# Altium project HYDRA_V3_RECOVERY.PrjPcb (part 1 of 2)
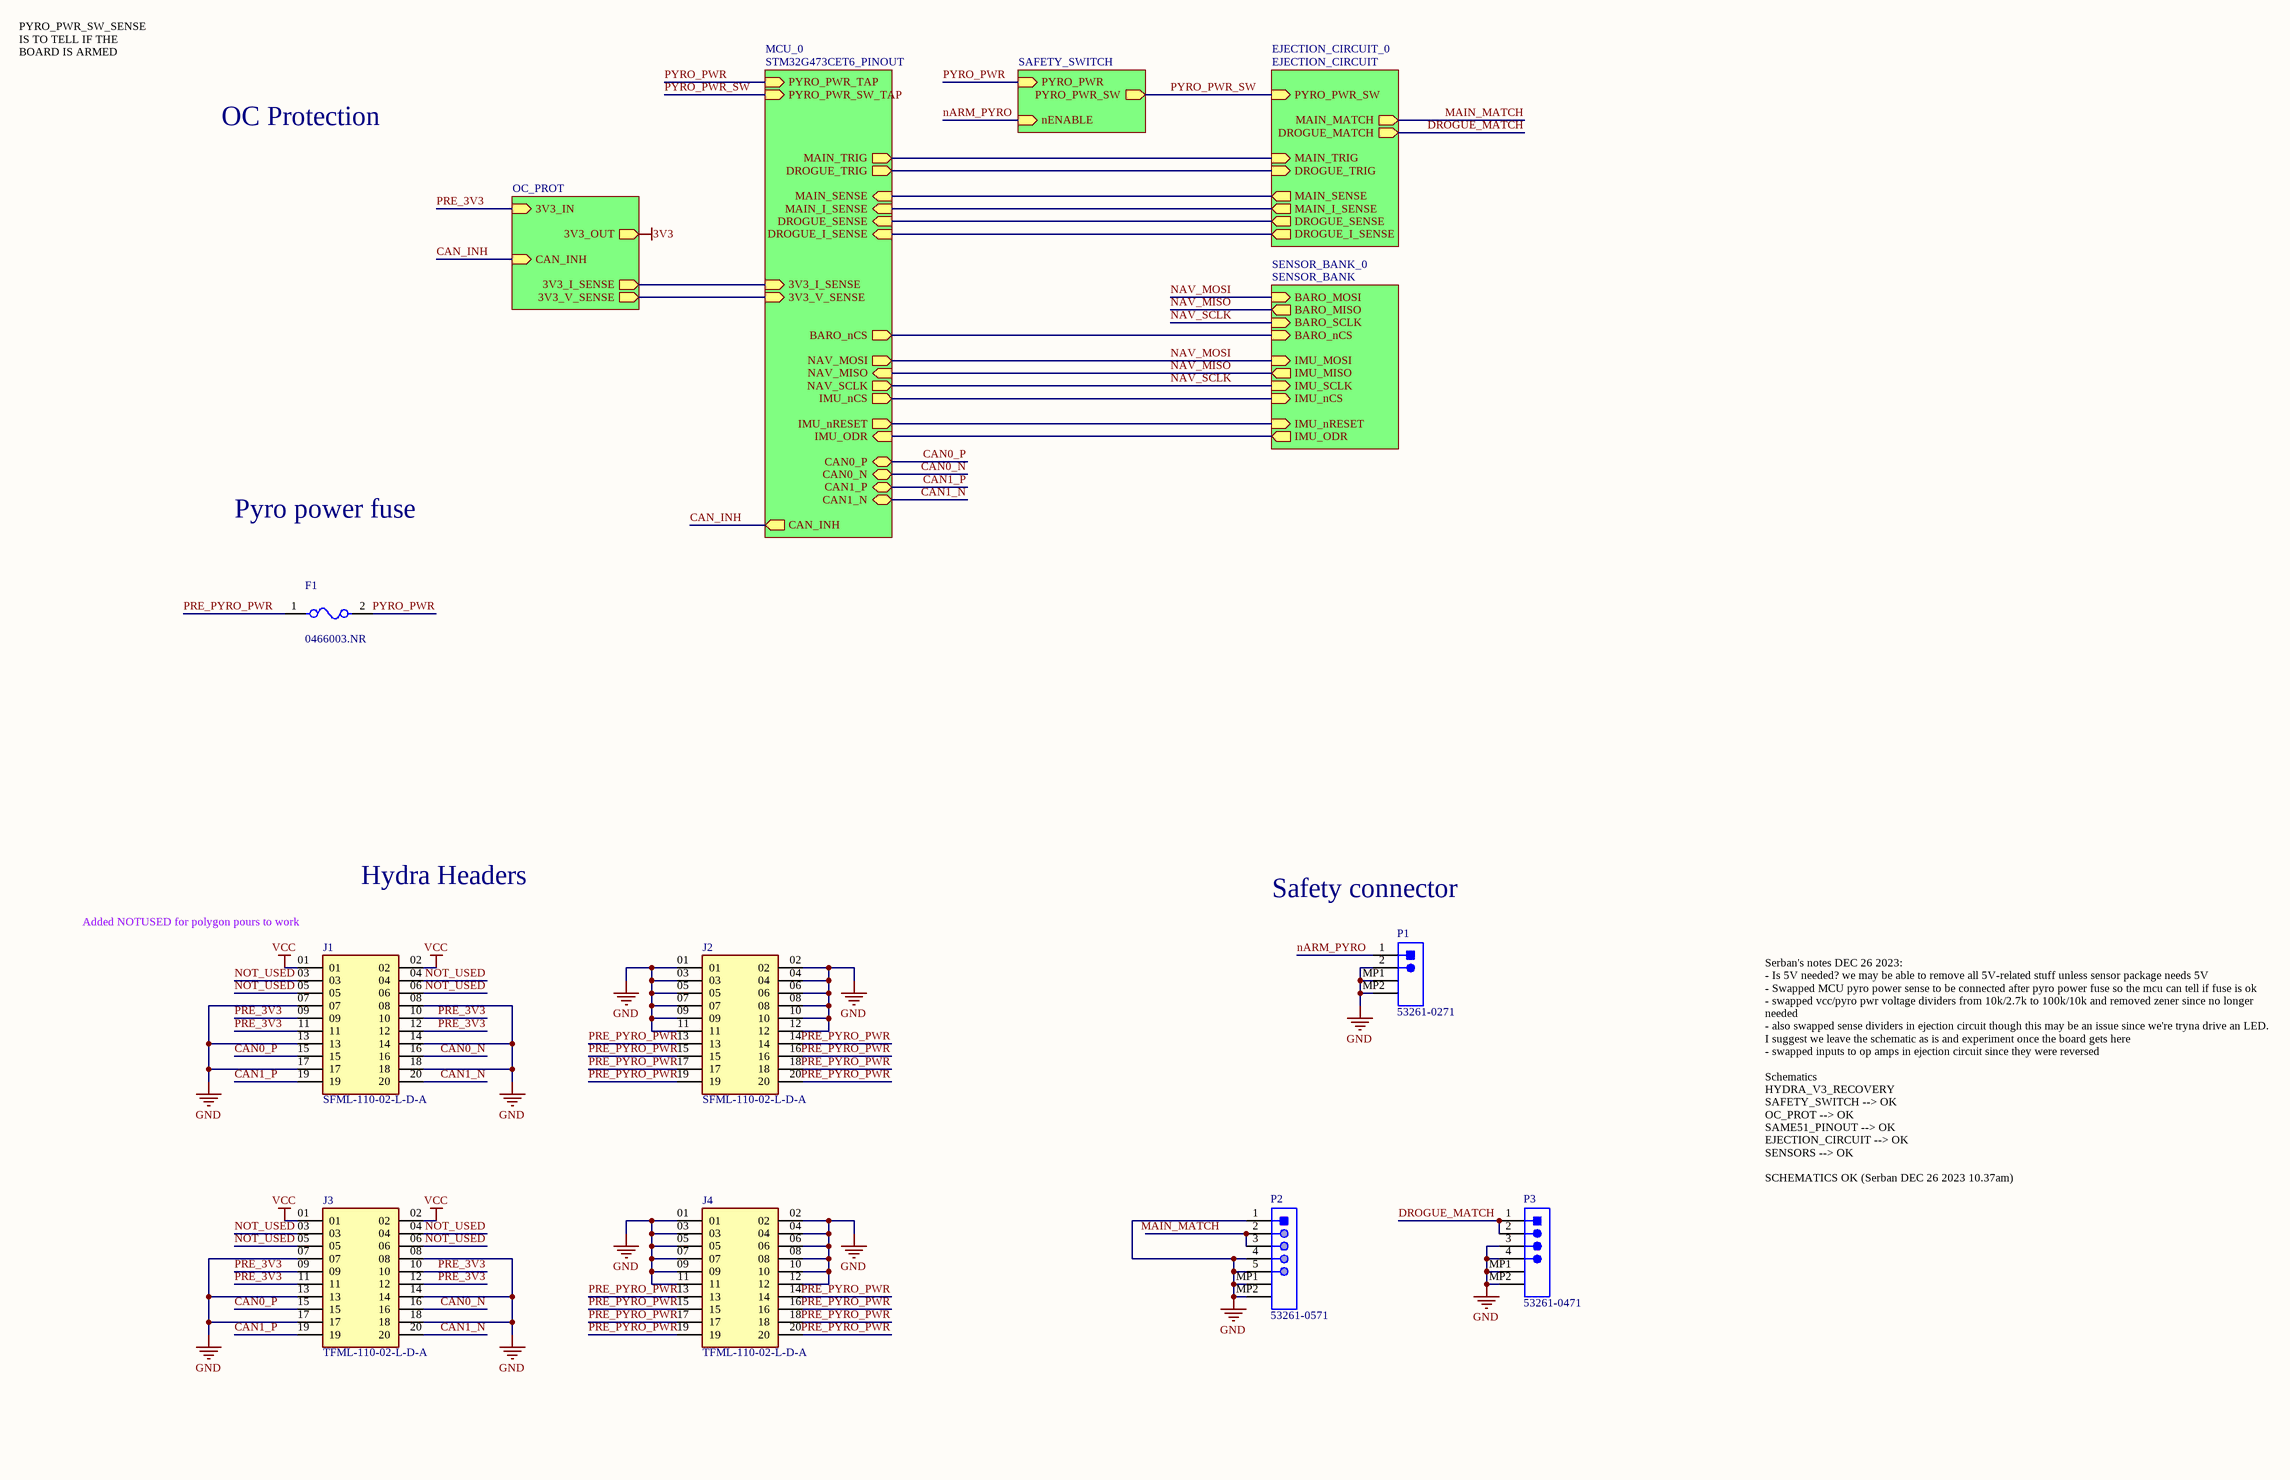
[diagram p0: HYDRA_V3_RECOVERY.SchDoc]
6 sheets, 129 parts. Net scope: hierarchical (ports join the sheet entries above them; power ports are global).
Board files: HYDRA_V3_RECOVERY.PcbDoc, HYDRA_V3_RECOVERY_V2.PcbDoc
Sheets:
  HYDRA_V3_RECOVERY.SchDoc
    OC_PROT = OC_PROT.SchDoc
    MCU_0 = STM32G473CET6_PINOUT.SchDoc
    EJECTION_CIRCUIT_0 = EJECTION_CIRCUIT.SchDoc
    SENSOR_BANK_0 = SENSOR_BANK.SchDoc
    SAFETY_SWITCH_0 = SAFETY_SWITCH.SchDoc

## Sheet HYDRA_V3_RECOVERY.SchDoc
size C; SheetNumber: 1; SheetTotal: 6

### Parts
F1  0466003.NR  [FP-0466-MFG]
J1  SFML-110-02-L-D-A  [SFML-110-02-L-D-A-Footprint-1]
J2  SFML-110-02-L-D-A  [SFML-110-02-L-D-A-Footprint-1]
J3  TFML-110-02-L-D-A  [TFML-110-02-L-D-A-Footprint-1]
J4  TFML-110-02-L-D-A  [TFML-110-02-L-D-A-Footprint-1]
P1  53261-0271  [MOLX-53261-0271_V]
P2  53261-0571  [MOLX-52361-0571-5_V]
P3  53261-0471  [MOLEX-53261-0471_V]

### Sub-sheets
EJECTION_CIRCUIT_0 = EJECTION_CIRCUIT: MAIN_TRIG (in), DROGUE_TRIG (in), PYRO_PWR_SW (in), MAIN_SENSE (out), DROGUE_SENSE (out), MAIN_I_SENSE (out), DROGUE_I_SENSE (out), MAIN_MATCH (out), DROGUE_MATCH (out)
MCU_0 = STM32G473CET6_PINOUT: MAIN_TRIG (out), DROGUE_TRIG (out), MAIN_SENSE (in), MAIN_I_SENSE (in), DROGUE_SENSE (in), DROGUE_I_SENSE (in), BARO_nCS (out), IMU_nCS (out), IMU_nRESET (out), IMU_ODR (in), CAN0_P (bidir), CAN0_N (bidir), CAN1_P (bidir), CAN1_N (bidir), CAN_INH (out), NAV_MOSI (out), NAV_MISO (in), NAV_SCLK (out), 3V3_I_SENSE (in), 3V3_V_SENSE (in), PYRO_PWR_TAP (in), PYRO_PWR_SW_TAP (in)
OC_PROT = OC_PROT: 3V3_IN (in), 3V3_OUT (out), CAN_INH (in), 3V3_I_SENSE (out), 3V3_V_SENSE (out)
SAFETY_SWITCH_0 = SAFETY_SWITCH: PYRO_PWR (in), PYRO_PWR_SW (out), nENABLE (in)
SENSOR_BANK_0 = SENSOR_BANK: IMU_MOSI (in), IMU_MISO (out), IMU_ODR (out), IMU_nCS (in), IMU_SCLK (in), IMU_nRESET (in), BARO_SCLK (in), BARO_MOSI (in), BARO_MISO (out), BARO_nCS (in)

### Nets
GND: J1.07 J1.08 J1.13 J1.14 J1.17 J1.18 J2.01 J2.02 J2.03 J2.04 J2.05 J2.06 J2.07 J2.08 J2.09 J2.10 J2.11 J2.12 J3.07 J3.08 J3.13 J3.14 J3.17 J3.18 J4.01 J4.02 J4.03 J4.04 J4.05 J4.06 J4.07 J4.08 J4.09 J4.10 J4.11 J4.12 P1.2 P1.MP1 P1.MP2 P2.1 P2.4 P2.5 P2.MP1 P2.MP2 P3.3 P3.4 P3.MP1 P3.MP2
VCC: J1.01 J1.02 J3.01 J3.02
3V3_I_SENSE: sheet OC_PROT/3V3_I_SENSE, sheet MCU_0/3V3_I_SENSE
BARO_nCS: sheet MCU_0/BARO_nCS, sheet SENSOR_BANK_0/BARO_nCS
CAN0_N: J1.16 J3.16 ; sheet MCU_0/CAN0_N
CAN0_P: J1.15 J3.15 ; sheet MCU_0/CAN0_P
CAN1_N: J1.20 J3.20 ; sheet MCU_0/CAN1_N
CAN1_P: J1.19 J3.19 ; sheet MCU_0/CAN1_P
CAN_INH: sheet OC_PROT/CAN_INH, sheet MCU_0/CAN_INH
DROGUE_I_SENSE: sheet MCU_0/DROGUE_I_SENSE, sheet EJECTION_CIRCUIT_0/DROGUE_I_SENSE
DROGUE_MATCH: P3.1 P3.2 ; sheet EJECTION_CIRCUIT_0/DROGUE_MATCH
DROGUE_SENSE: sheet MCU_0/DROGUE_SENSE, sheet EJECTION_CIRCUIT_0/DROGUE_SENSE
DROGUE_TRIG: sheet MCU_0/DROGUE_TRIG, sheet EJECTION_CIRCUIT_0/DROGUE_TRIG
IMU_nCS: sheet MCU_0/IMU_nCS, sheet SENSOR_BANK_0/IMU_nCS
IMU_nRESET: sheet MCU_0/IMU_nRESET, sheet SENSOR_BANK_0/IMU_nRESET
IMU_ODR: sheet MCU_0/IMU_ODR, sheet SENSOR_BANK_0/IMU_ODR
MAIN_I_SENSE: sheet MCU_0/MAIN_I_SENSE, sheet EJECTION_CIRCUIT_0/MAIN_I_SENSE
MAIN_MATCH: P2.2 P2.3 ; sheet EJECTION_CIRCUIT_0/MAIN_MATCH
MAIN_SENSE: sheet MCU_0/MAIN_SENSE, sheet EJECTION_CIRCUIT_0/MAIN_SENSE
MAIN_TRIG: sheet MCU_0/MAIN_TRIG, sheet EJECTION_CIRCUIT_0/MAIN_TRIG
nARM_PYRO: P1.1 ; sheet SAFETY_SWITCH_0/nENABLE
NAV_MISO: sheet MCU_0/NAV_MISO, sheet SENSOR_BANK_0/IMU_MISO, sheet SENSOR_BANK_0/BARO_MISO  [project net BARO_MISO]
NAV_MOSI: sheet MCU_0/NAV_MOSI, sheet SENSOR_BANK_0/IMU_MOSI, sheet SENSOR_BANK_0/BARO_MOSI  [project net BARO_MOSI]
NAV_SCLK: sheet MCU_0/NAV_SCLK, sheet SENSOR_BANK_0/IMU_SCLK, sheet SENSOR_BANK_0/BARO_SCLK  [project net BARO_SCLK]
NOT_USED: J1.03 J1.04 J1.05 J1.06 J3.03 J3.04 J3.05 J3.06
PRE_3V3: J1.09 J1.10 J1.11 J1.12 J3.09 J3.10 J3.11 J3.12 ; sheet OC_PROT/3V3_IN  [project net 3V3_PRE_SHUNT]
PRE_PYRO_PWR: F1.1 J2.13 J2.14 J2.15 J2.16 J2.17 J2.18 J2.19 J2.20 J4.13 J4.14 J4.15 J4.16 J4.17 J4.18 J4.19 J4.20
PYRO_PWR: F1.2 ; sheet MCU_0/PYRO_PWR_TAP, sheet SAFETY_SWITCH_0/PYRO_PWR
PYRO_PWR_SW: sheet MCU_0/PYRO_PWR_SW_TAP, sheet EJECTION_CIRCUIT_0/PYRO_PWR_SW, sheet SAFETY_SWITCH_0/PYRO_PWR_SW
NetR51_2: sheet OC_PROT/3V3_V_SENSE, sheet MCU_0/3V3_V_SENSE

### Notes on the sheet
- PYRO_PWR_SW_SENSE IS TO TELL IF THE BOARD IS ARMED
- OC Protection
- Pyro power fuse
- Hydra Headers
- Safety connector
- (near J1) Added NOTUSED for polygon pours to work
- Serban's notes DEC 26 2023:
  - Is 5V needed? we may be able to remove all 5V-related stuff unless sensor package needs 5V
  - Swapped MCU pyro power sense to be connected after pyro power fuse so the mcu can tell if fuse is ok
  - swapped vcc/pyro pwr voltage dividers from 10k/2.7k to 100k/10k and removed zener since no longer needed
  - also swapped sense dividers in ejection circuit though this may be an issue since we're tryna drive an LED. I suggest we leave the schematic as is and experiment once the board gets here
  - swapped inputs to op amps in ejection circuit since they were reversed
  Schematics
  HYDRA_V3_RECOVERY
  SAFETY_SWITCH --> OK
  OC_PROT --> OK
  SAME51_PINOUT --> OK
  EJECTION_CIRCUIT --> OK
  SENSORS --> OK
  SCHEMATICS OK (Serban DEC 26 2023 10.37am)

### Library data of the parts
F1 = CMP-08605-000054-1: FUSE BOARD MNT 3A 32VAC/VDC 1206; Manufacturer: Littelfuse; Fuse Interrupt Ac Current: 50A; Fuse Voltage Drop: 75.99mV; Max Fuse Ac Voltage: 32V; Fuse I2T: 0.576A2Sec; Resistance: 0.019Ω; Fuse Blow Speed: Fast; Value: 0.019Ω; ComponentLink2Description: Datasheet; Fuse Current: 3A; RoHS: TRUE; Mouser Description: Surface Mount Fuses 32V 3A VFA Slimline; Height: 0.66mm; Octopart: https://octopart.com/0466003.nr-littelfuse-565175; Package: 0466; Fuse Interrupt Dc Current: 50A; Manufacturer Part Number: 0466003.NR; Temperature Range Low: -55°C; ComponentLink2URL: https://www.littelfuse.com/~/media/electronics/datasheets/fuses/littelfuse_fuse_466_datasheet.pdf.pdf; Digikey Description: FUSE BOARD MNT 3A 32VAC/VDC 1206; Voltage Rating: 32V; Category: Fuse; Lead Free: Yes; Device Class L2: Fuses; Automotive: No; Max Fuse Dc Voltage: 32V; Temperature Range High: +90°C; Device Class L3: unset; Device Class L1: Circuit Protection; Temperature: -55°C to +90°C
J1 J2 = CMP-002-00043-1: Board Connector, 20 Contact(s), 2 Row(s), Female, Straight, 0.05 inch Pitch, Surface Mount Terminal, Locking, Black Insulator, Socket; RoHS Compliant: Yes; Connector Type: BOARD CONNECTOR; Mounting Technology: Board
J3 J4 = CMP-002-00042-1: Board Connector, 20 Contact(s), 2 Row(s), Male, Straight, Surface Mount Terminal; Connector Type: BOARD CONNECTOR; Mounting Technology: Board; RoHS Compliant: Yes
P1 = CMP-2000-05633-1: PicoBlade(TM) Header, Right Angle, -40 to 85 degC, 2-Pin SMD, RoHS, Tape and Reel; Current - Max: 1A; Brand: Molex; Voltage Rating: 125V; Number of Positions: 2; Pitch: 1.25mm; Package Version: Rev. H, 11/2014; Factory Pack Quantity: 1000; Datasheet URL: http://www.molex.com/webdocs/datasheets/pdf/en-us/0532610271_PCB_HEADERS.pdf; Datasheet Version: 03/2016; Housing Material: Thermoplastic; RoHS: Details; Product Type: Headers; Number of Rows: 1; Termination Style: SMD; Mounting Technology: SurfaceMount; Number of Positions / Contacts: 2; Package URL: http://www.molex.com/pdm_docs/sd/532610271_sd.pdf; Mounting Angle: Right; Mounting Style: SMD/SMT; Manufacturer: Molex; Product Category: 1.25mmConnectors; Tradename: PicoBlade; Voltage - Max: 125V; Manufacturer URL: http://www.molex.com/; Series: 53261; Package Description: 2-Leads Header, Pitch 1.25 mm, Mated Height 3.4 mm; Package Reference: 53261-0271; Current Rating: 1A; Contact Plating: Tin; Contact Material: PhosphorBronze; Type: Shrouded; Packaging: Reel
P2 = CMP-2000-05249-1: Male Header, Pitch 1.25 mm, 1 x 5 Position, Height 3.4 mm, RoHS, Tape and Reel; Brand: Molex; Mounting Angle: Right; Number of Positions: 5; Voltage Rating: 125V; Current Rating: 1A; Pitch: 1.25mm; Datasheet Version: Rev. D, 04/2004; Housing Material: Thermoplastic; Series: 53261; RoHS: Details; Product Category: Headers&WireHousings; Datasheet URL: http://datasheet.octopart.com/532610571-Molex-datasheet-8343080.pdf; Manufacturer URL: http://www.molex.com/; Contact Material: PhosphorBronze; Tradename: PicoBlade; Number of Rows: 1; Product Type: Headers; Manufacturer: Molex; Type: Shrouded; Termination Style: SMD; Mounting Style: SMD/SMT; Factory Pack Quantity: 1000; Contact Plating: Tin; Packaging: Reel; Number of Positions / Contacts: 5
P3 = CMP-2000-05238-1: Male Header, Pitch 1.25 mm, 1 x 4 Position, Height 3.4 mm, -40 to 85 degC, RoHS, Tape and Reel; Current Rating: 1A; Brand: Molex; Number of Positions / Contacts: 4; Pitch: 1.25mm; Voltage Rating: 125V; Mounting Angle: Right; Manufacturer URL: http://www.molex.com/; Factory Pack Quantity: 1000; Housing Material: Thermoplastic; Datasheet URL: http://www.molex.com/pdm_docs/sd/532610471_sd.pdf; Tradename: PicoBlade; Product Type: Headers; Contact Plating: Tin; Contact Material: PhosphorBronze; Package Description: 1.25mm Pitch PicoBlade(TM) Header, Surface Mount, Right Angle, Lead-Free, 4 Circuits; Mounting Style: SMD/SMT; Manufacturer: Molex; Series: 53261; Packaging: Reel; Number of Rows: 1; RoHS: Details; Number of Positions: 4; Product Category: Headers&WireHousings; Datasheet Version: Rev. G, 01/2012; Type: Shrouded; Termination Style: SMD

## Sheet OC_PROT.SchDoc
size C; SheetNumber: 2; SheetTotal: 6
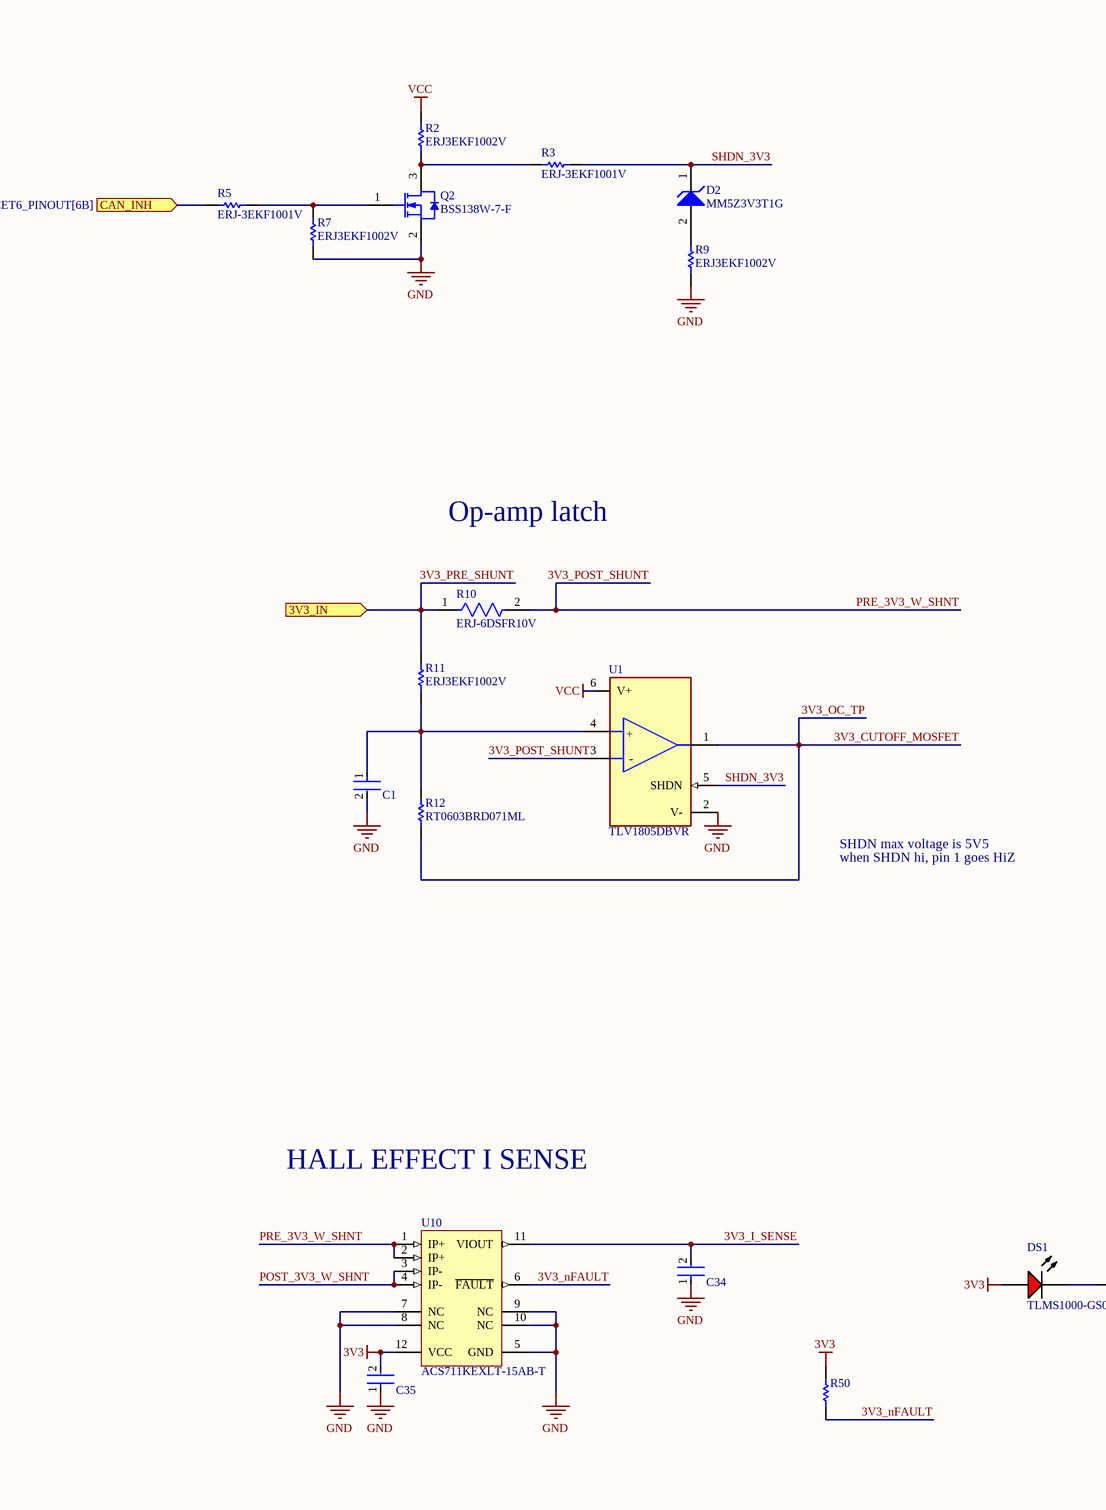
[diagram p1: OC_PROT.SchDoc, left]
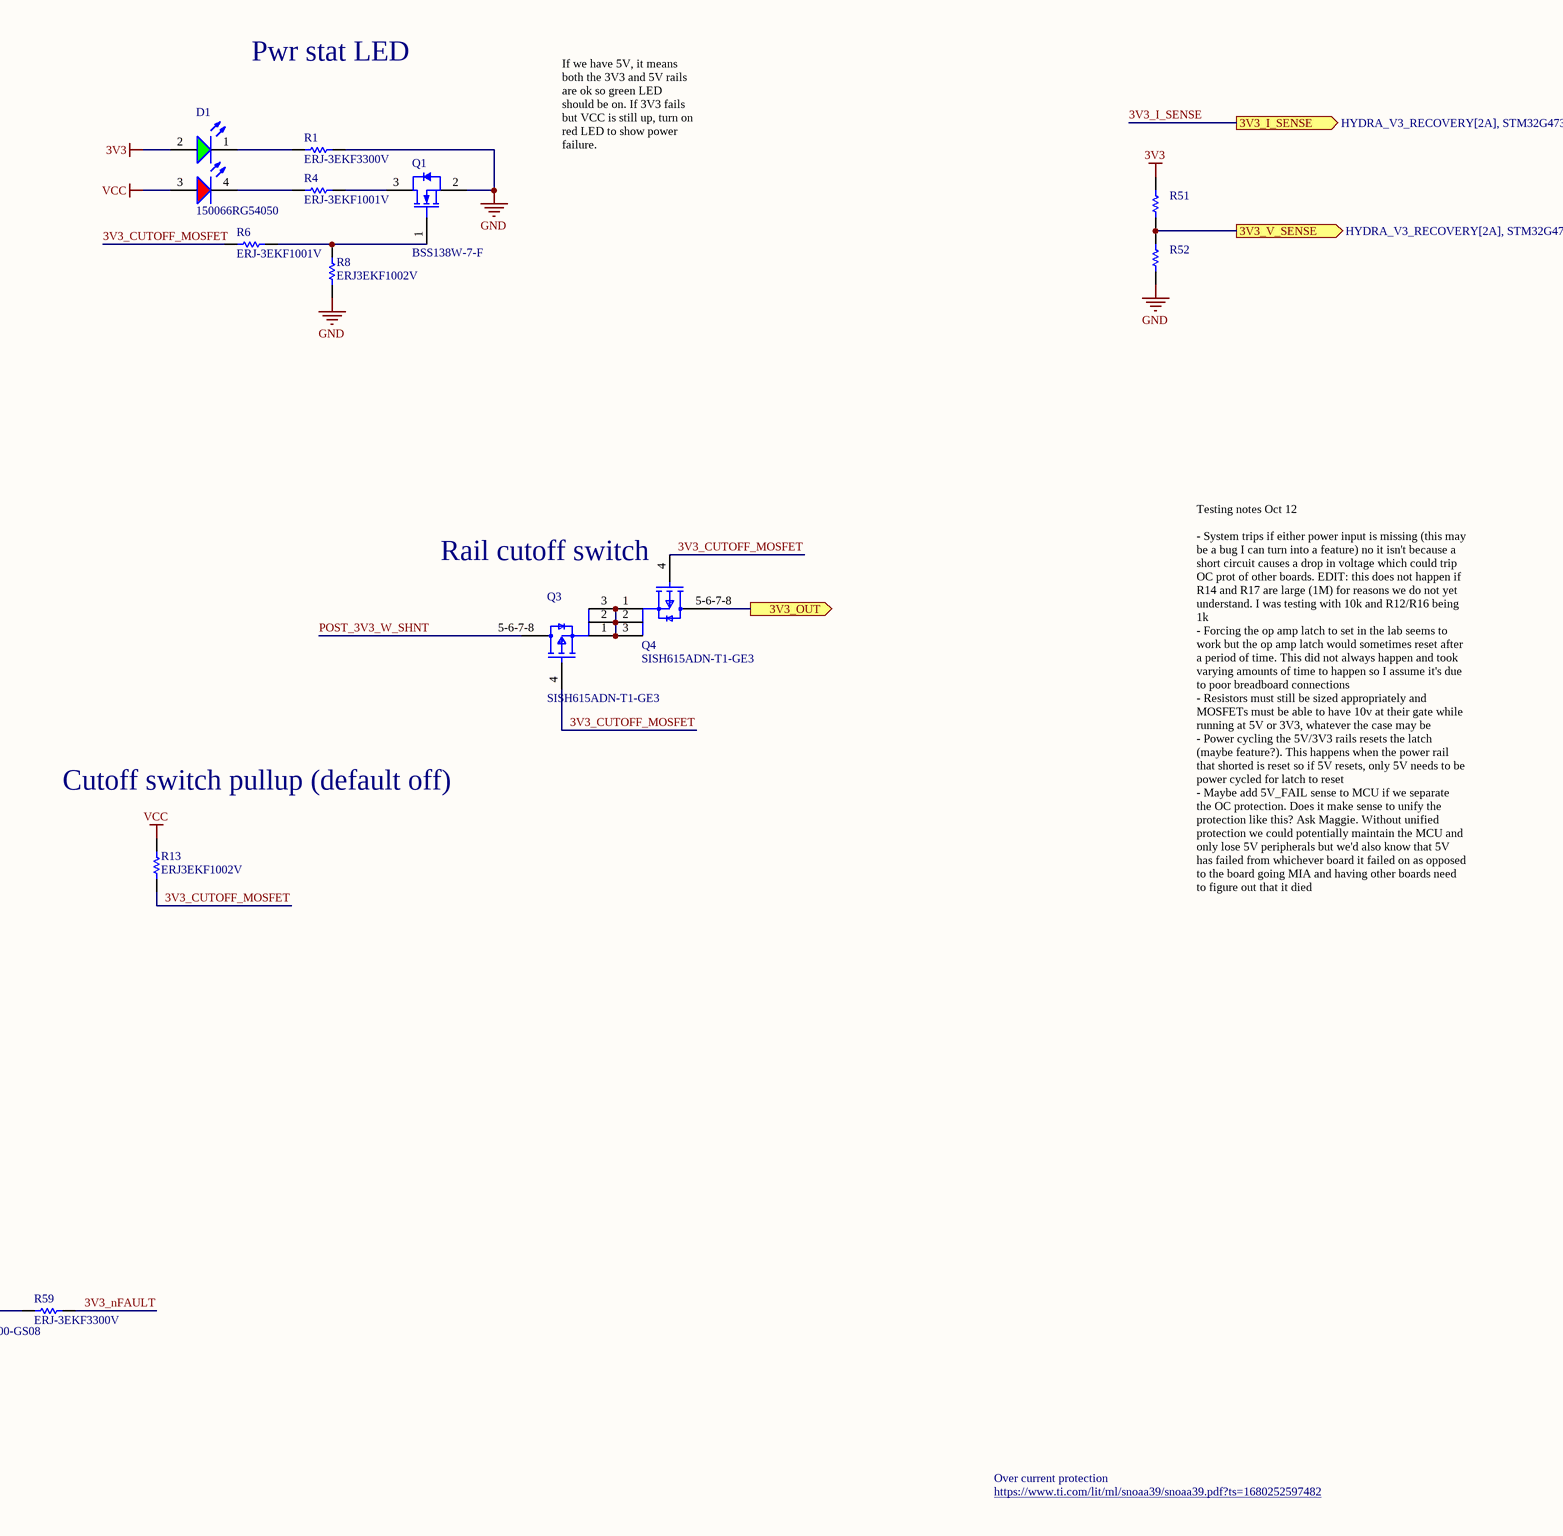
[diagram p2: OC_PROT.SchDoc, right]

### Parts
C1  C0402C104K8PACTU  [FP-C0402-BB-MFG]  (value not drawn)
C34  C0402C104K8PACTU  [FP-C0402-BB-MFG]  (value not drawn)
C35  C0402C104K8PACTU  [FP-C0402-BB-MFG]  (value not drawn)
D1  150066RG54050  [WL-SBCD_0606]
D2  MM5Z3V3T1G  [ONSC-SOD-523-2-502-01_V]
DS1  TLMS1000-GS08  [VISH-TLMS1000_V]
Q1  BSS138W-7-F  [DIOD-SOT323-3_V]
Q2  BSS138W-7-F  [DIOD-SOT323-3_V]
Q3  SISH615ADN-T1-GE3  [SISH615ADN-T1-GE3-Footprint-1]
Q4  SISH615ADN-T1-GE3  [SISH615ADN-T1-GE3-Footprint-1]
R1  ERJ-3EKF3300V  [RESC1608X55X30LL15T15]
R2  ERJ3EKF1002V  [RESC1609X55X30LL15T15]
R3  ERJ-3EKF1001V  [RESC1608X55X30LL15T15]
R4  ERJ-3EKF1001V  [RESC1608X55X30LL15T15]
R5  ERJ-3EKF1001V  [RESC1608X55X30LL15T15]
R6  ERJ-3EKF1001V  [RESC1608X55X30LL15T15]
R7  ERJ3EKF1002V  [RESC1609X55X30LL15T15]
R8  ERJ3EKF1002V  [RESC1609X55X30LL15T15]
R9  ERJ3EKF1002V  [RESC1609X55X30LL15T15]
R10  ERJ-6DSFR10V  [FP-ERJ6D-MFG]
R11  ERJ3EKF1002V  [RESC1609X55X30LL15T15]
R12  RT0603BRD071ML  [RESC1608X55X30NL20T20]
R13  ERJ3EKF1002V  [RESC1609X55X30LL15T15]
R50  ERJ3EKF1002V  [RESC1609X55X30LL15T15]  (value not drawn)
R51  ERJ3EKF1002V  [RESC1609X55X30LL15T15]  (value not drawn)
R52  ERJ3EKF1002V  [RESC1609X55X30LL15T15]  (value not drawn)
R59  ERJ-3EKF3300V  [RESC1608X55X30LL15T15]
U1  TLV1805DBVR  [FP-DBV0006A-IPC_C]
U10  ACS711KEXLT-15AB-T  [ALEG-EX-12_V]

### Ports
3V3_I_SENSE (out, see HYDRA_V3_RECOVERY[2A], STM32G473CET6_PINOUT[4A]), 3V3_IN (in, see HYDRA_V3_RECOVERY[2A]), 3V3_OUT (out, see HYDRA_V3_RECOVERY[2A]), 3V3_V_SENSE (out, see HYDRA_V3_RECOVERY[2A], STM32G473CET6_PINOUT[4A]), CAN_INH (in, see HYDRA_V3_RECOVERY[2A], STM32G473CET6_PINOUT[6B])

### Nets
3V3: C35.2 D1.2(A) DS1.1(A) Q4.5-6-7-8(D) R50.2 R51.1 U10.12(VCC) ; port 3V3_OUT
GND: C1.2 C34.1 C35.1 Q1.2(S) Q2.2(S) R1.2 R7.1 R8.1 R9.1 R52.2 U1.2(V-) U10.5(GND) U10.7(NC) U10.8(NC) U10.9(NC) U10.10(NC)
VCC: D1.3(A) R2.2 R13.1 U1.6(V+)
3V3_CUTOFF_MOSFET: Q3.4(G) Q4.4(G) R6.2 R12.1 R13.2 U1.1(OUT)  [also labelled 3V3_OC_TP]
3V3_I_SENSE: C34.2 U10.11(VIOUT) ; port 3V3_I_SENSE
3V3_nFAULT: R50.1 R59.2 U10.6(~{FAULT})
3V3_POST_SHUNT: R10.2 U1.3(-IN) U10.1(IP+) U10.2(IP+)  [also labelled PRE_3V3_W_SHNT]
3V3_PRE_SHUNT: R10.1 R11.2 ; port 3V3_IN
CAN_INH: R5.2 ; port CAN_INH
POST_3V3_W_SHNT: Q3.5-6-7-8(D) U10.3(IP-) U10.4(IP-)
SHDN_3V3: D2.1(K) R3.2 U1.5(SHDN)
NetC1_1: C1.1 R11.1 R12.2 U1.4(+IN)
NetD1_1: D1.1(K) R1.1
NetD1_4: D1.4(K) R4.2
NetD2_2: D2.2(A) R9.2
NetDS1_2: DS1.2(K) R59.1
NetQ1_1: Q1.1(G) R6.1 R8.2
NetQ1_3: Q1.3(D) R4.1
NetQ2_1: Q2.1(G) R5.1 R7.2
NetQ2_3: Q2.3(D) R2.1 R3.1
NetQ3_1: Q3.1(S) Q3.2(S) Q3.3(S) Q4.1(S) Q4.2(S) Q4.3(S)
NetR51_2: R51.2 R52.1 ; port 3V3_V_SENSE

### Notes on the sheet
- Pwr stat LED
- If we have 5V, it means both the 3V3 and 5V rails are ok so green LED should be on. If 3V3 fails but VCC is still up, turn on red LED to show power failure.
- Op-amp latch
- (near Q4) Rail cutoff switch
- Cutoff switch pullup (default off)
- SHDN max voltage is 5V5
- when SHDN hi, pin 1 goes HiZ
- Testing notes Oct 12
  - System trips if either power input is missing (this may be a bug I can turn into a feature) no it isn't because a short circuit causes a drop in voltage which could trip OC prot of other boards. EDIT: this does not happen if R14 and R17 are large (1M) for reasons we do not yet understand. I was testing with 10k and R12/R16 being 1k
  - Forcing the op amp latch to set in the lab seems to work but the op amp latch would sometimes reset after a period of time. This did not always happen and took varying amounts of time to happen so I assume it's due to poor breadboard connections
  - Resistors must still be sized appropriately and MOSFETs must be able to have 10v at their gate while running at 5V or 3V3, whatever the case may be
  - Power cycling the 5V/3V3 rails resets the latch (maybe feature?). This happens when the power rail that shorted is reset so if 5V resets, only 5V needs to be power cycled for latch to reset
  - Maybe add 5V_FAIL sense to MCU if we separate the OC protection. Does it make sense to unify the protection like this? Ask Maggie. Without unified protection we could potentially maintain the MCU and only lose 5V peripherals but we'd also know that 5V has failed from whichever board it failed on as opposed to the board going MIA and having other boards need to figure out that it died
- HALL EFFECT I SENSE
- https://www.ti.com/lit/ml/snoaa39/snoaa39.pdf?ts=1680252597482
- Over current protection
- (in symbol CMP-04896-000098-1) +; -

### Library data of the parts
C1 C34 C35 = CMP-2008-02046-2: CAP CER 0.1UF 10V X5R 0402; Manufacturer: Kemet; Material: Ceramic; Capacitance: 0.10 μF; Temperature Coefficient: 15%; Tolerance: 0.1; Value: 0.10 μF; Package: C0402-BB; Temperature: -55°C to +125°C; ComponentLink2Description: Datasheet; Temperature Characteristic: X5R; Device Class L1: Passive Components; Height: 0.55mm; Lead Free: Yes; ComponentLink2URL: https://content.kemet.com/datasheets/KEM_C1002_X7R_SMD.pdf; Device Class L2: Capacitors; Temperature Range Low: -55°C; Temperature Range High: +125°C; RoHS: TRUE; Octopart: https://octopart.com/c0402c104k8pactu-kemet-140039; Automotive: No; Mouser Description: Capacitor 100 nF 10 VDC 0402; Category: Cap; Voltage Rating: 10 V; Digikey Description: CAP CER 0.1UF 10V X5R 0402; Ipc Land Pattern Name: CAPC10050X50; Device Class L3: Ceramic Capacitors; Manufacturer Part Number: C0402C104K8PACTU
D1 = CMP-004-00040-2: Led, Red/Grn, 180Mcd/230Mcd, 624Nm/525Nm Rohs Compliant: Yes; Source: rgled.SchLib; Component Type: Standard; Design Item ID: CMP-004-00034-2; Pins: 4
D2 = CMP-1060-00750-1: Zener Voltage Regulator, 500 mW, 2-Pin SOD-523, Pb-Free, Tape and Reel; Manufacturer: On Semiconductor; P Max (W): 0.5; VZ Typ (V): 3.3; RoHS: Pb-Free; ComponentLink2Description: Datasheet; PackageReference: SOD-523-2-502-01; DatasheetVersion: Rev. 10; ComponentLink1Description: Manufacturer URL; PackageVersion: Rev. E, 09/2010; ComponentLink3URL: http://www.onsemi.com/pub_link/Collateral/502-01.PDF; ComponentLink2URL: http://www.onsemi.cn/pub_link/Collateral/MM5Z2V4T1-D.PDF; Mounting Technology: Surface Mount; PartNumber: MM5Z3V3T1G; Packing: Tape and Reel; PackageDescription: 2-Pin SOD, Body 1.2 x 0.8 mm; ComponentLink1URL: http://www.onsemi.com/; ComponentLink3Description: Package Specification
DS1 = CMP-2000-07254-1: Low Current LED, 40 mW, 1.8 V, -40 to 100 degC, 2-Pin SMD (0603), RoHS, Tape and Reel; Manufacturer: Vishay; Lens Shape: Rectangular; Automotive Qualification Standard: AEC-Q100; Wavelength Typ: 636nm; SVHC: ToBeAdvised; LED Colour: Red; Bulb Size: 1.6mmx0.8mm; Forward Voltage: 1.8V; Luminous Intensity: 4mcd; Forward Current If: 2mA; Viewing Angle: 80°; Datasheet Version: Rev. 1.7, 02/2011; Datasheet URL: https://datasheet.ciiva.com/5798/1698881-5798337.pdf; LED Mounting: SMD; Packaging: CutTape; Package Reference: TLMS1000; Manufacturer URL: http://www.vishay.com/; Mounting Technology: SurfaceMount; Product Range: -; Package Description: 2-Pin Surface Mount Device, Body 1.6 x 0.8 mm; MSL: MSL2-1year
Q1 Q2 = CMP-2000-05968-1: N-Channel Enhancement Mode Mosfet, 50 V, 200 mA, -55 to 150 degC, 6-Pin SOT-323, RoHS, Tape and Reel; Typical Turn-Off Delay Time: 20ns; Number of Channels: 1Channel; Type: EnhancementModeFieldEffectTransistor; Brand: DiodesIncorporated; Vds - Drain-Source Breakdown Voltage: 75V; Vgs - Gate-Source Voltage: 20V; Rds On - Drain-Source Resistance: 1.4Ohms; Transistor Type: 1N-Channel; Configuration: Single; Unit Weight: 0.000212oz; Pd - Power Dissipation: 200mW; Id - Continuous Drain Current: 200mA; Forward Transconductance - Min: 0.1S; Manufacturer URL: http://www.diodes.com/; Series: BSS138; Package Description: 3-Pin Small Outline Transistor, Body 2 x 1.25 mm, Pitch 0.65 mm; Mounting Technology: SurfaceMount; Product Category: MOSFET; RoHS: True; Maximum Operating Temperature: +150C; Height: 1mm; Length: 2.2mm; Technology: Si; Width: 1.35mm; Datasheet URL: http://www.diodes.com/_files/datasheets/ds30206.pdf; Manufacturer: DiodesIncorporated; Package / Case: SOT-323-3; Typical Turn-On Delay Time: 20ns; Transistor Polarity: N-Channel; Factory Pack Quantity: 3000; Packaging: Reel; Product: MOSFETSmallSignal; Datasheet Version: Rev. 11-2, 09/2013; Package Reference: SOT323; Minimum Operating Temperature: -55C; Mounting Style: SMD/SMT; Channel Mode: Enhancement
Q3 Q4 = CMP-013-00018-2: Trans MOSFET P-CH 20V 22.1A 8-Pin PowerPAK 1212 EP T/R; Source: SISH615ADN-T1-GE3.SchLib; Design Item ID: CMP-013-00036-4; Component Type: Standard; Pins: 5
R1 R59 = CMP-2000-00435-2: Chip Resistor, 330 Ohm, +/- 1%, 0.1 W, -55 to 155 degC, 0603 (1608 Metric), RoHS, Tape and Reel; Gender: Male; Mating Cycles: 10000; Current Rating: 500 mA; Voltage Rating: 10 V; REACH SVHC: No SVHC; PackageDescription: 2-Pin Surface Mount Device, Body 1.6 x 0.85 mm; Contact Finish: Gold; Pins: 8; ComponentLink1Description: Manufacturer URL; Packaging: Tape and Reel; Max Operating Temperature: 85 degC; Contact Material: Copper; Height: 1.45 mm; Width: 1.45 mm; DatasheetVersion: Apr-15; Package Quantity: 1500; Contact Plating: Gold; PackageReference: 0603; Mount: Surface Mount; Lead Pitch: 1.1 mm; Min Operating Temperature: -25 degC; ComponentLink1URL: http://www.panasonic.com/; ComponentLink2URL: http://industrial.panasonic.com/cdbs/www-data/pdf/RDA0000/AOA0000C86.pdf; Length: 13.7 mm; ComponentLink2Description: Datasheet; RoHSCompliant: true
R2 R7-R9 R11 R13 R50-R52 = CMP-1012-00623-3: Chip Resistor, 10 KOhm, +/- 1%, 0.1 W, -55 to 155 degC, 0603 (1608 Metric), RoHS, Tape and Reel; Manufacturer: Panasonic; Voltage Rating: 75V; Case\/Package: 0603; Power Rating: 100mW; Resistance: 10KOhm; Temperature Coefficient: 100ppm\/degreesC; Number of Pins: 2; Package Reference: 603; Depth: 0.8mm; Mount: SurfaceMount; Package Description: 2-Pin Surface Mount Device, Body 1.6 x 0.85 mm; Datasheet Version: 02/2017; Length: 1.6mm; Lead Free: LeadFree; Height: 0.45mm; Number of Terminations: 2; Max Power Dissipation: 100mW; Min Operating Temperature: -55degC; Datasheet URL: https://industrial.panasonic.com/cdbs/www-data/pdf/RDA0000/AOA0000C304.pdf; Termination: SMD/SMT; Case Code (Metric): 1608; Case Code (Imperial): 0603; Tolerance: 1%; Max Operating Temperature: 155degC; RoHSCompliant: true; Voltage Rating (DC): 75V; Radiation Hardening: No; Packaging: TapeandReel; Composition: ThickFilm; Mounting Technology: SurfaceMount; Manufacturer URL: http://www.panasonic.com/; Width: 0.031inch; REACH SVHC: NoSVHC; Contact Plating: Tin; Military Standard: Not; Package Quantity: 1
R3-R6 = CMP-2000-00180-1: Manufacturer: Panasonic; Part Number: ERJ-3EKF1001V
R10 = CMP-05422-000098-1: RES 0.1 OHM 1% 1/2W 0805; Temperature Coefficient: 150ppm/°C; Resistance: 100mR; Max Power Dissipation: 500mW; Tolerance: 1%; Length: 0.079inch; Features: Automotive AEC-Q200; Width: 0.049inch; Resistor Type: Thick Film; Case Code (Metric): 2012; Number of Terminations: 2; Max Operating Temperature: 155°C; Case/Package: 0805; Height: 0.028inch; Packaging: Cut Tape; Case Code (Imperial): 0805; Min Operating Temperature: -55°C
R12 = CMP-2000-00925-1: NOT PANASONIC, THIS IS A 1M RESISTORhttps://www.yageo.com/upload/media/product/productsearch/datasheet/rchip/PYu-RT_1-to-0.01_RoHS_L_13.pdf; Part Number: ERA-3AEB163V; Manufacturer: Panasonic
U1 = CMP-04896-000098-1: 40V, RAIL-TO-RAIL INPUT, PUSH-PU
U10 = CMP-1557-00001-1: Hall Effect Linear Current Sensor with Overcurrent Fault Output for <100 V Isolation Applications, 3 to 5.5 V, -15.5 to 15.5 A IP, -40 to 125 degC, 12-Pin QFN (EX), RoHS, Tape and Reel; VCC Max: 5.5 V; IP Max: 15.5 A; VCC Min: 3 V; IP Min: -15.5 A; -3dB Bandwidth: 0.1 MHz; PackageDescription: 12-Pin Quad Flat No-Lead, Body 3 x 3 mm, Height 0.8 mm; ComponentLink1URL: http://www.allegromicro.com/; Packing: Tape and Reel; ComponentLink2URL: http://www.allegromicro.com/~/media/Files/Datasheets/ACS711-Datasheet.ashx?la=en; DatasheetVersion: Rev. 3; PartNumber: ACS711KEXLT-15AB-T; ComponentLink2Description: Datasheet; ComponentLink3URL: http://www.allegromicro.com/~/media/Files/Datasheets/ACS711-Datasheet.ashx?la=en; RoHS: TRUE; ComponentLink1Description: Manufacturer URL; ComponentLink3Description: Package Specification; Temperature Max: 125 degC; Mounting Technology: Surface Mount; Temperature Min: -40 degC

## Sheet STM32G473CET6_PINOUT.SchDoc
size C; SheetNumber: 6; SheetTotal: 6
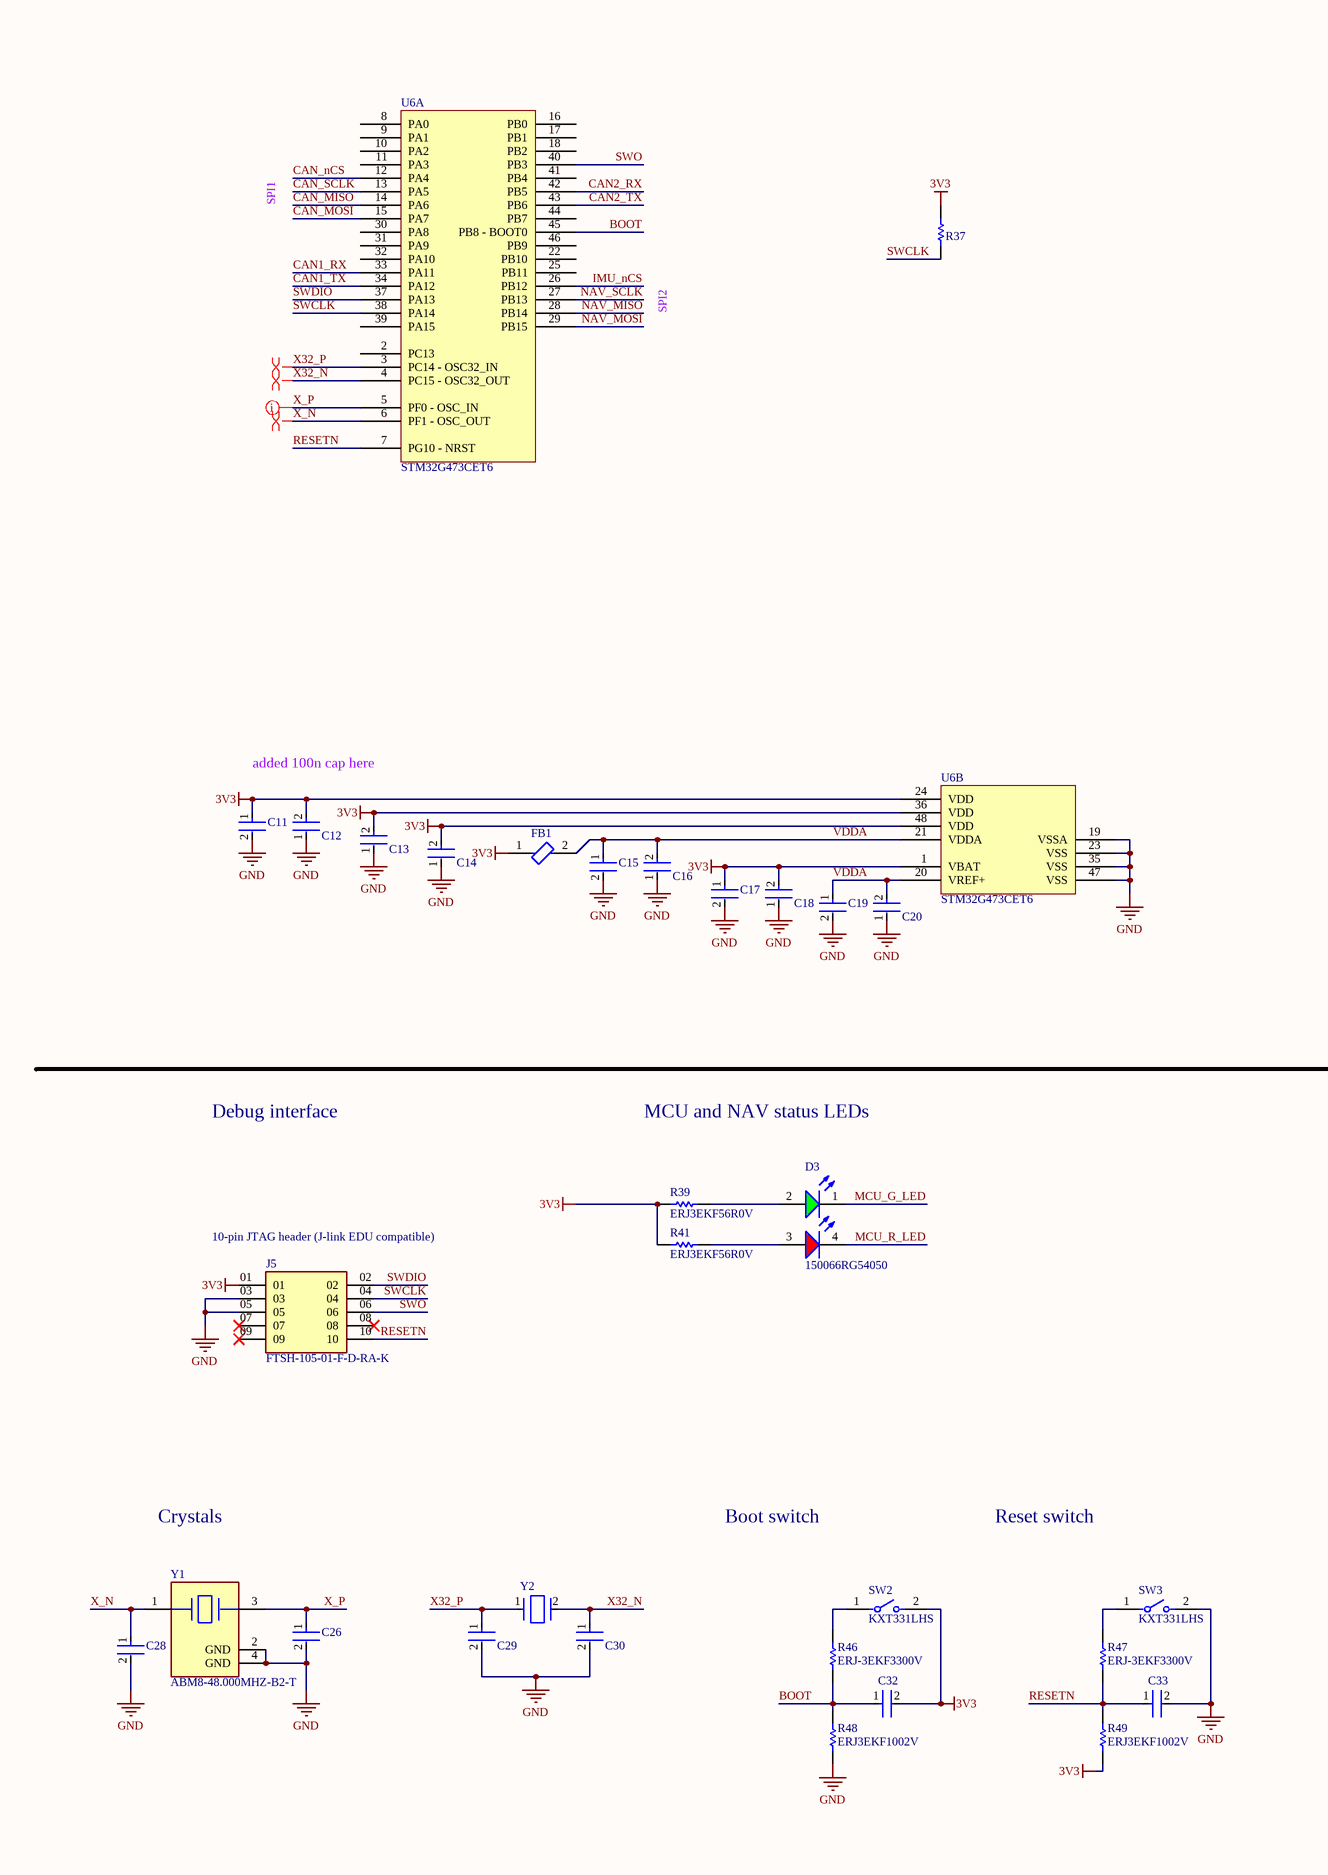
[diagram p3: STM32G473CET6_PINOUT.SchDoc, left]
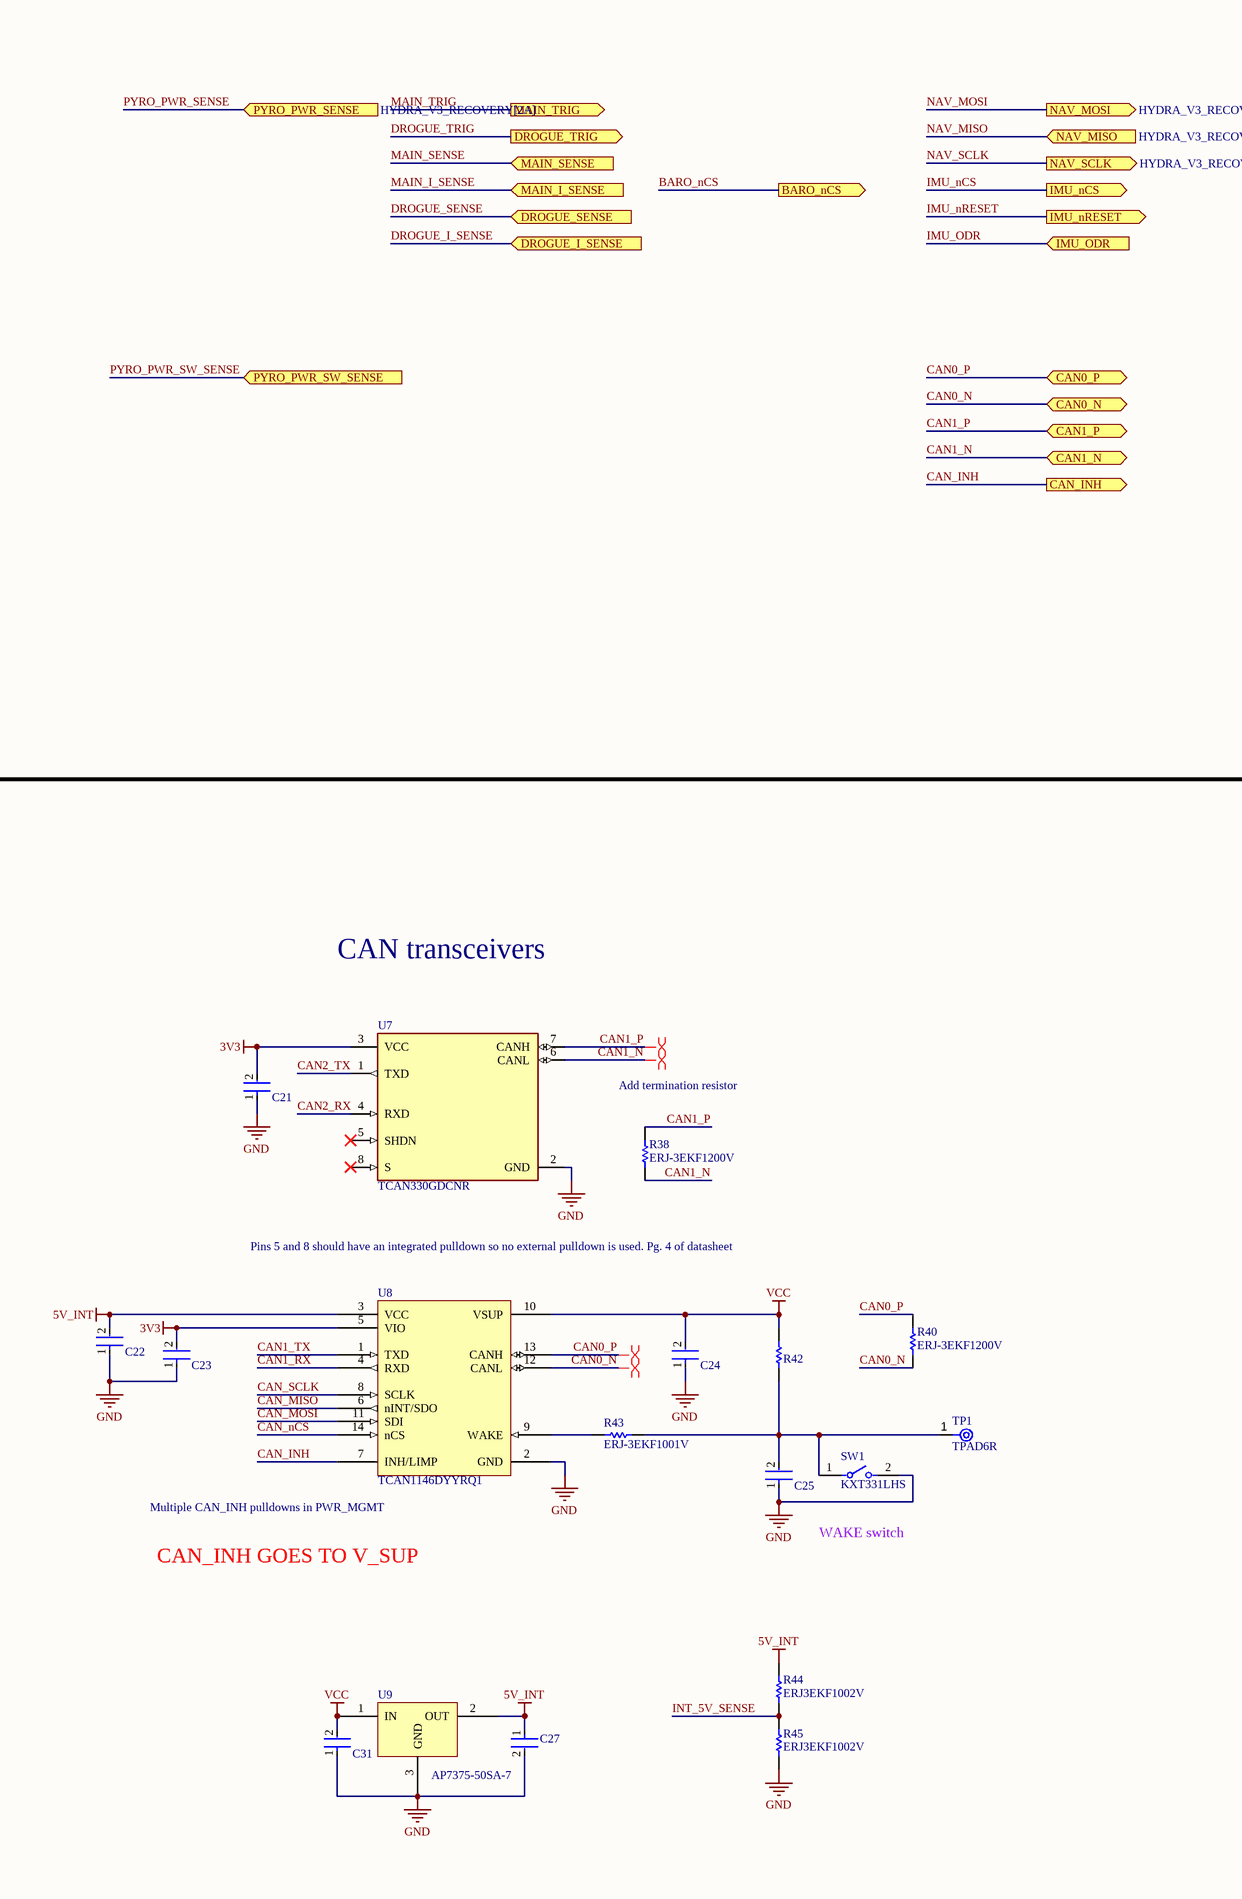
[diagram p4: STM32G473CET6_PINOUT.SchDoc, right]

### Parts
C11  C1005X5R1A475K050BC  [FP-C1005-050-0_15-MFG]  (value not drawn)
C12  GRM155R71C104KA88D  [FP-GRM15-MFG]  (value not drawn)
C13  GRM155R71C104KA88D  [FP-GRM15-MFG]  (value not drawn)
C14  GRM155R71C104KA88D  [FP-GRM15-MFG]  (value not drawn)
C15  EMK105BJ105KV-F  [FP-0402-L_1_0_0_05-W_0_5-IPC_A]  (value not drawn)
C16  GRM155R71C104KA88D  [FP-GRM15-MFG]  (value not drawn)
C17  EMK105BJ105KV-F  [FP-0402-L_1_0_0_05-W_0_5-IPC_A]  (value not drawn)
C18  GRM155R71C104KA88D  [FP-GRM15-MFG]  (value not drawn)
C19  EMK105BJ105KV-F  [FP-0402-L_1_0_0_05-W_0_5-IPC_A]  (value not drawn)
C20  GRM155R71C104KA88D  [FP-GRM15-MFG]  (value not drawn)
C21  C0402C104K8PACTU  [FP-C0402-BB-MFG]  (value not drawn)
C22  C0402C104K8PACTU  [FP-C0402-BB-MFG]  (value not drawn)
C23  C0402C104K8PACTU  [FP-C0402-BB-MFG]  (value not drawn)
C24  C0402C104K8PACTU  [FP-C0402-BB-MFG]  (value not drawn)
C25  C0402C104K8PACTU  [FP-C0402-BB-MFG]  (value not drawn)
C26  C0402C689C5GACTU  [FP-C0402-BB-MFG]  (value not drawn)
C27  CL05A106MP5NUNC  [FP-CL05A106MP5NUNC-MFG]  (value not drawn)
C28  C0402C689C5GACTU  [FP-C0402-BB-MFG]  (value not drawn)
C29  04025A180FAT2A  [FP-0402-L_1_0_1-W_0_5_0_1-IPC_A]  (value not drawn)
C30  04025A180FAT2A  [FP-0402-L_1_0_1-W_0_5_0_1-IPC_A]  (value not drawn)
C31  C0402C104K8PACTU  [FP-C0402-BB-MFG]  (value not drawn)
C32  C0402C104K8PACTU  [FP-C0402-BB-MFG]  (value not drawn)
C33  C0402C104K8PACTU  [FP-C0402-BB-MFG]  (value not drawn)
D3  150066RG54050  [WL-SBCD_0606]
FB1  BLM15PX601SN1D  [FP-BLM15-0_05-MFG]  (value not drawn)
J5  FTSH-105-01-F-D-RA-K  [FTSH-105-01-F-D-RA-K-Footprint-1]
R37  ERJ3EKF1002V  [RESC1609X55X30LL15T15]  (value not drawn)
R38  ERJ-3EKF1200V  [RESC1609X55X30ML15T15]
R39  ERJ3EKF56R0V  [RESC1608X55X30NL15T15]
R40  ERJ-3EKF1200V  [RESC1609X55X30ML15T15]
R41  ERJ3EKF56R0V  [RESC1608X55X30NL15T15]
R42  ERJ3EKF1002V  [RESC1609X55X30LL15T15]  (value not drawn)
R43  ERJ-3EKF1001V  [RESC1608X55X30LL15T15]
R44  ERJ3EKF1002V  [RESC1609X55X30LL15T15]
R45  ERJ3EKF1002V  [RESC1609X55X30LL15T15]
R46  ERJ-3EKF3300V  [RESC1608X55X30LL15T15]
R47  ERJ-3EKF3300V  [RESC1608X55X30LL15T15]
R48  ERJ3EKF1002V  [RESC1609X55X30LL15T15]
R49  ERJ3EKF1002V  [RESC1609X55X30LL15T15]
SW1  KXT331LHS  [FP-KXT331LHS-MFG]
SW2  KXT331LHS  [FP-KXT331LHS-MFG]
SW3  KXT331LHS  [FP-KXT331LHS-MFG]
TP1  TPAD6R  [New footprint 1]
U6  STM32G473CET6  [TSQFP50P900X900X160-48N]  (parts A,B of 2)
U7  TCAN330GDCNR  [FP-DCN0008A-MFG]
U8  TCAN1146DYYRQ1  [TCAN1146DYYRQ1-Footprint-1]
U9  AP7375-50SA-7  [AP7375-50SA-7-Footprint-1]
Y1  ABM8-48.000MHZ-B2-T  [FP-ABM8-MFG]
Y2  ECS-.327-12.5-1210-TR  [FP-ECX-1210-MFG]  (value not drawn)

### Ports
BARO_nCS (out, see HYDRA_V3_RECOVERY[3A], SENSOR_BANK[4A]), CAN0_N (bidir, see HYDRA_V3_RECOVERY[3B]), CAN0_P (bidir, see HYDRA_V3_RECOVERY[3B]), CAN1_N (bidir, see HYDRA_V3_RECOVERY[3B]), CAN1_P (bidir, see HYDRA_V3_RECOVERY[3B]), CAN_INH (out, see HYDRA_V3_RECOVERY[2B], OC_PROT[1B]), DROGUE_I_SENSE (in, see HYDRA_V3_RECOVERY[3A], EJECTION_CIRCUIT[5A]), DROGUE_SENSE (in, see HYDRA_V3_RECOVERY[3A], EJECTION_CIRCUIT[5A]), DROGUE_TRIG (out, see HYDRA_V3_RECOVERY[3A], EJECTION_CIRCUIT[1A]), IMU_nCS (out, see HYDRA_V3_RECOVERY[3A], SENSOR_BANK[4B]), IMU_nRESET (out, see HYDRA_V3_RECOVERY[3B], SENSOR_BANK[4B]), IMU_ODR (in, see HYDRA_V3_RECOVERY[3B], SENSOR_BANK[4B]), MAIN_I_SENSE (in, see HYDRA_V3_RECOVERY[3A], EJECTION_CIRCUIT[5A]), MAIN_SENSE (in, see HYDRA_V3_RECOVERY[3A], EJECTION_CIRCUIT[5A]), MAIN_TRIG (out, see HYDRA_V3_RECOVERY[3A], EJECTION_CIRCUIT[1A]), NAV_MISO (in, see HYDRA_V3_RECOVERY[3A]), NAV_MOSI (out, see HYDRA_V3_RECOVERY[3A]), NAV_SCLK (out, see HYDRA_V3_RECOVERY[3A]), PYRO_PWR_SENSE (in, see HYDRA_V3_RECOVERY[2A]), PYRO_PWR_SW_SENSE (in, see HYDRA_V3_RECOVERY[2A])

### Nets
3V3: C11.1 C12.2 C13.2 C14.2 C17.1 C18.2 C21.2 C23.2 C32.2 FB1.1 J5.01 R37.1 R39.2 R41.2 R49.1 SW2.2 U6.1(VBAT) U6.24(VDD) U6.36(VDD) U6.48(VDD) U7.3(VCC) U8.5(VIO)
5V_INT: C22.2 C27.1 R44.2 U8.3(VCC) U9.2(OUT)
GND: C11.2 C12.1 C13.1 C14.1 C15.2 C16.1 C17.2 C18.1 C19.2 C20.1 C21.1 C22.1 C23.1 C24.1 C25.1 C26.2 C27.2 C28.2 C29.2 C30.2 C31.1 C33.2 J5.03 J5.05 R45.2 R48.1 SW1.2 SW3.2 U6.19(VSSA) U6.23(VSS) U6.35(VSS) U6.47(VSS) U7.2(GND) U8.2(GND) U9.3(GND) Y1.2(GND) Y1.4(GND)
VCC: C24.2 C31.2 R42.1 U8.10(VSUP) U9.1(IN)
BOOT: C32.1 R46.1 R48.2 U6.45(PB8_-_BOOT0)
CAN0_N: R40.2 U8.12(CANL) ; port CAN0_N
CAN0_P: R40.1 U8.13(CANH) ; port CAN0_P
CAN1_N: R38.1 U7.6(CANL) ; port CAN1_N
CAN1_P: R38.2 U7.7(CANH) ; port CAN1_P
CAN1_RX: U6.33(PA11) U8.4(RXD)
CAN1_TX: U6.34(PA12) U8.1(TXD)
CAN2_RX: U6.42(PB5) U7.4(RXD)
CAN2_TX: U6.43(PB6) U7.1(TXD)
CAN_INH: U8.7(INH/LIMP) ; port CAN_INH
CAN_MISO: U6.14(PA6) U8.6(nINT/SDO)
CAN_MOSI: U6.15(PA7) U8.11(SDI)
CAN_nCS: U6.12(PA4) U8.14(nCS)
CAN_SCLK: U6.13(PA5) U8.8(SCLK)
IMU_nCS: U6.26(PB12) ; port IMU_nCS
INT_5V_SENSE: R44.1 R45.1
MCU_G_LED: D3.1(K)
MCU_R_LED: D3.4(K)
NAV_MISO: U6.28(PB14) ; port NAV_MISO  [project net BARO_MISO]
NAV_MOSI: U6.29(PB15) ; port NAV_MOSI  [project net BARO_MOSI]
NAV_SCLK: U6.27(PB13) ; port NAV_SCLK  [project net BARO_SCLK]
PYRO_PWR_SENSE: port PYRO_PWR_SENSE
PYRO_PWR_SW_SENSE: port PYRO_PWR_SW_SENSE
RESETN: C33.1 J5.10 R47.1 R49.2 U6.7(PG10_-_NRST)
SWCLK: J5.04 R37.2 U6.38(PA14)
SWDIO: J5.02 U6.37(PA13)
SWO: J5.06 U6.40(PB3)
VDDA: C15.1 C16.2 C19.1 C20.2 FB1.2 U6.20(VREF+) U6.21(VDDA)
X32_N: C30.1 U6.4(PC15_-_OSC32_OUT) Y2.2(Out/In)
X32_P: C29.1 U6.3(PC14_-_OSC32_IN) Y2.1(In/Out)
X_N: C28.1 U6.6(PF1_-_OSC_OUT) Y1.1
X_P: C26.1 U6.5(PF0_-_OSC_IN) Y1.3
NetC25_2: C25.2 R42.2 R43.2 SW1.1 TP1.1(TP)
NetD3_2: D3.2(A) R39.1
NetD3_3: D3.3(A) R41.1
NetR43_1: R43.1 U8.9(WAKE)
NetR46_2: R46.2 SW2.1
NetR47_2: R47.2 SW3.1

Not connected (* = marked no-connect by the designer): J5 07* 08* 09*; U6 2(PC13) 8(PA0) 9(PA1) 10(PA2) 11(PA3) 16(PB0) 17(PB1) 18(PB2) 22(PB10) 25(PB11) 30(PA8) 31(PA9) 32(PA10) 39(PA15) 41(PB4) 44(PB7) 46(PB9); U7 5(SHDN)* 8(S)*

### Layout directives
differential pair: CAN1_N, CAN1_P, X32_N, X32_P, X_N, X_P
differential pair; differential pair class 120DIFF: CAN0_N, CAN0_P

### Notes on the sheet
- SPI1
- SPI2
- added 100n cap here
- CAN transceivers
- (near R38) Add termination resistor
- Debug interface
- MCU and NAV status LEDs
- Pins 5 and 8 should have an integrated pulldown so no external pulldown is used. Pg. 4 of datasheet
- (near J5) 10-pin JTAG header (J-link EDU compatible)
- (near U8) Multiple CAN_INH pulldowns in PWR_MGMT
- WAKE switch
- CAN_INH GOES TO V_SUP
- Crystals
- Boot switch
- Reset switch

### Library data of the parts
C11 = CMP-2000-05997-2: CAP CER 4.7UF 10V X5R 0402; Dielectric Material: Ceramic; Tolerance: 10%; Series: C; Package Quantity: 10000; Max Operating Temperature: 85°C; Case Code (Imperial): 0402; Lead Free: Lead Free; Voltage Rating (DC): 10V; Packaging: Cut Tape; Voltage Rating: 10V; Min Operating Temperature: -55°C; Dielectric: X5R; Thickness: 0.022inch; Width: 0.02inch; Case/Package: 0402; Case Code (Metric): 1005; Capacitance: 4.7uF; Length: 0.039inch; RoHS Compliant: Yes; REACH SVHC: No SVHC; Mount: Surface Mount
C12-C14 C16 C18 C20 = CMP-2100-03641-2: CAP CER 0.1UF 16V X7R 0402; Manufacturer: Murata; Standoff Height: 0mm; Tolerance: 10%; Voltage Rating: 16Vdc; Material: Ceramic; Capacitance: 0.10μF; Value: 0.10μF; RoHS: TRUE; Manufacturer Part Number: GRM155R71C104KA88D; Temperature Characteristic: X7R; Octopart: https://octopart.com/grm155r71c104ka88d-murata-196880; Digikey Description: CAP CER 0.1UF 16V X7R 0402; Device Class L3: Ceramic Capacitors; Height: 0.55mm; ComponentLink2Description: Datasheet; Temperature Range Low: -55°C; Ipc Land Pattern Name: CAPC10050X219; ComponentLink2URL: https://search.murata.co.jp/Ceramy/image/img/A01X/G101/ENG/GRM155R71H471KA01-01A.pdf; Device Class L1: Passive Components; Lead Free: yes; Category: Cap; Package: GRM15; Temperature: -55°C to +125°C; Device Class L2: Capacitors; Temperature Range High: +125°C; Mouser Description: 0402 0.1 uF 16V ±10 % Tolerance X7R SMT Multilayer Ceramic Capacitor
C15 C17 C19 = CMP-14477-000104-2: None; Tolerance: 10%; Voltage Rating: 16V; Dielectric: X5R; Capacitance: 1uF; Packaging: Tape and Reel; Depth: 0.5mm; Mount: Surface Mount; Thickness: 0.022inch; Package Quantity: 1; Min Operating Temperature: -55°C; Series: M; Voltage Rating (DC): 16V; Termination: SMD/SMT; Case/Package: 0402; Number of Pins: 2; Case Code (Imperial): 0402; Length: 1mm; Halogen Free: Halogen Free; Case Code (Metric): 1005; Width: 0.02inch; RoHS Compliant: Yes; Radiation Hardening: No; Max Operating Temperature: 85°C; Height: 0.5mm; Construction: Flat
C21-C25 C31-C33 = CMP-2008-02046-2: as C1 on sheet OC_PROT; Package: C0402-BB; Temperature: -55°C to +125°C; ComponentLink2Description: Datasheet; Temperature Characteristic: X5R; Device Class L1: Passive Components; Height: 0.55mm; Lead Free: Yes; ComponentLink2URL: https://content.kemet.com/datasheets/KEM_C1002_X7R_SMD.pdf; Device Class L2: Capacitors; Temperature Range Low: -55°C; Temperature Range High: +125°C; RoHS: TRUE; Octopart: https://octopart.com/c0402c104k8pactu-kemet-140039; Automotive: No; Mouser Description: Capacitor 100 nF 10 VDC 0402; Category: Cap; Voltage Rating: 10 V; Digikey Description: CAP CER 0.1UF 10V X5R 0402; Ipc Land Pattern Name: CAPC10050X50; Device Class L3: Ceramic Capacitors; Manufacturer Part Number: C0402C104K8PACTU
C26 C28 = CMP-1034-00517-3: CAP CER 6.8PF 50V NP0 0402; Manufacturer: Kemet; Material: Ceramic; Temperature Characteristic: C0G; Tolerance: 0.25 pF; Temperature Coefficient: 15%; ComponentLink2URL: https://content.kemet.com/datasheets/KEM_C1002_X7R_SMD.pdf; Octopart: https://octopart.com/c0402c689c5gactu-kemet-9143567; RoHS: TRUE; Temperature: -55°C to +125°C; Device Class L2: Capacitors; ComponentLink2Description: Datasheet; Mouser Description: Cap Ceramic 6.8pF 50V C0G 0.25pF SMD 0402 125°C Paper T/R; Device Class L3: Ceramic Capacitors; Digikey Description: CAP CER 6.8PF 50V NP0 0402; Temperature Range High: +125°C; Package: C0402-BB; Voltage Rating: 50 V; Height: 0.55mm; Ipc Land Pattern Name: CAPC10050X50; Value: 6.8 pF; Device Class L1: Passive Components; Category: Cap; Manufacturer Part Number: C0402C689C5GACTU; Capacitance: 6.8 pF; Lead Free: Yes; Automotive: No; Temperature Range Low: -55°C
C27 = CMP-13271-000002-1: CAP CER 10UF 10V X5R 0402; Manufacturer: Samsung; Temperature Coefficient: 15%; Tolerance: 20%; Material: Ceramic; Octopart: https://octopart.com/cl05a106mp5nunc-samsung-22457395; Voltage Rating: 10V; RoHS: TRUE; Value: 10uF; Height: 0.7mm; Digikey Description: CAP CER 10UF 10V X5R 0402; Automotive: No; Package: CL05A106MP5NUNC; Device Class L1: Passive Components; Capacitance: 10uF; Temperature Range High: +85°C; ComponentLink2Description: Datasheet; Device Class L2: Capacitors; Temperature Characteristic: X5R; Manufacturer Part Number: CL05A106MP5NUNC; Temperature: -55°C to +85°C; ComponentLink2URL: http://www.samsungsem.com/kr/support/product-search/mlcc/__icsFiles/afieldfile/2019/05/10/19-CL05A106MP5NUNC.pdf; Device Class L3: Ceramic Capacitors; Category: Cap; Temperature Range Low: -55°C; Ipc Land Pattern Name: CAPC10050X50; Lead Free: Yes
C29 C30 = CMP-2008-02590-2: General Purpose Ceramic Capacitor, 0402, 18pF, 1%, C0G, 30ppm/°C, 50V; Depth: 0.5mm; Packaging: Tape and Reel; Number of Pins: 2; Tolerance: 1%; Min Operating Temperature: -55°C; Capacitance: 18pF; Termination: SMD/SMT; Lead Free: Lead Free; Case Code (Metric): 1005; Radiation Hardening: No; Package Quantity: 1; Max Operating Temperature: 125°C; Voltage Rating: 50V; Construction: Flat; Dielectric: C0G; Length: 1mm; REACH SVHC: No SVHC; Case Code (Imperial): 0402; Series: -; RoHS Compliant: Yes; Voltage Rating (DC): 50V; Mount: Surface Mount; Case/Package: 0402; Width: 0.5mm; Thickness: 0.022inch; Contact Plating: Tin
D3 = CMP-004-00040-2: as D1 on sheet OC_PROT; Source: rgled.SchLib; Component Type: Standard; Design Item ID: CMP-004-00034-2; Pins: 4
FB1 = CMP-0686-00252-4: Chip Ferrite Bead, 0402, 600Ω @ 100MHz, 0.23Ω, 25%, 900mA; Number of Circuits: 1; Impedance: 600R; DC Resistance (DCR): 230mR; Material: Steel; Length: 1mm; Package Quantity: 10000; Height: 0.5mm; Width: 0.5mm; Max DC Current: 900mA; Number of Lines: 1; Termination: SMD/SMT; Packaging: Tape and Reel; Lead Free: Lead Free; Min Operating Temperature: -55°C; Max Operating Temperature: 125°C; Max Current Rating: 900mA; Case Code (Imperial): 0402; Number of Pins: 2; Current Rating: 900mA; Test Frequency: 100MHz; Case/Package: 0402; Tolerance: 25%; Case Code (Metric): 1005
J5 = CMP-002-00041-5: Board Connector, 10 Contact(s), 2 Row(s), Male, Right Angle, 0.05 inch Pitch, Surface Mount Terminal, Locking, Black Insulator; Connector Type: BOARD CONNECTOR; Mounting Technology: Board; RoHS Compliant: Yes
R37 R42 R44 R45 R48 R49 = CMP-1012-00623-3: as R2 on sheet OC_PROT; Number of Pins: 2; Package Reference: 603; Depth: 0.8mm; Mount: SurfaceMount; Package Description: 2-Pin Surface Mount Device, Body 1.6 x 0.85 mm; Datasheet Version: 02/2017; Length: 1.6mm; Lead Free: LeadFree; Height: 0.45mm; Number of Terminations: 2; Max Power Dissipation: 100mW; Min Operating Temperature: -55degC; Datasheet URL: https://industrial.panasonic.com/cdbs/www-data/pdf/RDA0000/AOA0000C304.pdf; Termination: SMD/SMT; Case Code (Metric): 1608; Case Code (Imperial): 0603; Tolerance: 1%; Max Operating Temperature: 155degC; RoHSCompliant: true; Voltage Rating (DC): 75V; Radiation Hardening: No; Packaging: TapeandReel; Composition: ThickFilm; Mounting Technology: SurfaceMount; Manufacturer URL: http://www.panasonic.com/; Width: 0.031inch; REACH SVHC: NoSVHC; Contact Plating: Tin; Military Standard: Not; Package Quantity: 1
R38 R40 = CMP-2000-00213-2: Chip Resistor, 120 Ohm, +/- 1%, 0.1 W, -55 to 155 degC, 0603 (1608 Metric), RoHS, Tape and Reel; Manufacturer: Panasonic; Power Rating: 100mW; Voltage Rating (DC): 75V; Resistance: 120Ohm; Temperature Coefficient: 100ppm/degreesC; Number of Terminations: 2; Military Standard: Not; Tolerance: 1%; Min Operating Temperature: -55degC; Packaging: TapeandReel; Lead Free: LeadFree; Max Operating Temperature: 155degC; Manufacturer URL: http://www.panasonic.com/; Case Code (Imperial): 0603; REACH SVHC: NoSVHC; Width: 0.031inch; Datasheet URL: https://industrial.panasonic.com/cdbs/www-data/pdf/RDA0000/AOA0000C283.pdf; RoHSCompliant: true; Max Power Dissipation: 100mW; Termination: SMD/SMT; Package Reference: 0603; Height: 0.022inch; Depth: 0.8mm; Package Description: 2-Pin Surface Mount Device, Body 1.6 x 0.85 mm; Contact Plating: Tin; Length: 1.6mm; Package URL: http://www.st.com/st-web-ui/static/active/en/resource/technical/document/datasheet/CD00001320.pdf; Radiation Hardening: No; Package Quantity: 1; Number of Pins: 2; Datasheet Version: 42095.0; Voltage Rating: 75V; Composition: ThickFilm; Case/Package: 0603; Mount: SurfaceMount; Case Code (Metric): 1608
R39 R41 = CMP-2000-00572-1: Manufacturer: Panasonic; Part Number: ERJ3EKF56R0V
R43 = CMP-2000-00180-1: Manufacturer: Panasonic; Part Number: ERJ-3EKF1001V
R46 R47 = CMP-2000-00435-2: as R1 on sheet OC_PROT; REACH SVHC: No SVHC; PackageDescription: 2-Pin Surface Mount Device, Body 1.6 x 0.85 mm; Contact Finish: Gold; Pins: 8; ComponentLink1Description: Manufacturer URL; Packaging: Tape and Reel; Max Operating Temperature: 85 degC; Contact Material: Copper; Height: 1.45 mm; Width: 1.45 mm; DatasheetVersion: Apr-15; Package Quantity: 1500; Contact Plating: Gold; PackageReference: 0603; Mount: Surface Mount; Lead Pitch: 1.1 mm; Min Operating Temperature: -25 degC; ComponentLink1URL: http://www.panasonic.com/; ComponentLink2URL: http://industrial.panasonic.com/cdbs/www-data/pdf/RDA0000/AOA0000C86.pdf; Length: 13.7 mm; ComponentLink2Description: Datasheet; RoHSCompliant: true
SW1-SW3 = CMP-10040-000029-1: SWITCH TACTILE SPST-NO 0.02A 15V; Operating Force: 240gf; Switch Travel: 0.13mm; Illumination Type: Non-Illuminated; Throw Configuration: SPST; Number of Ports: 1; Current Rating: 5A; Mechanical Life: 500000Cycles; Switch Function: Off-Mom; Connector Type: USB; Actuator Type: Standard; Gender: Receptacle; Number of Contacts: 24; Contact Plating: Gold; Insulation Color: Black; Min Operating Temperature: -40°C; Packaging: Tape and Reel; Flammability Rating: UL94 V-0; Max Operating Temperature: 85°C; Termination: Solder; Mount: Surface Mount
TP1 = CMP-00025-2: Test Point .6mm
U6 = CMP-020-00018-2: RISC Microcontroller, 32-Bit, 170MHz; RoHS Compliant: Yes
U7 = CMP-04872-000178-1: IC TRANSCEIVER 1/1 SOT23-8; Data Rate: 1Mbps; Packaging: Tape and Reel; Min Operating Temperature: -40°C; Max Operating Temperature: 125°C; RoHS Compliant: Yes; Lead Free: Lead Free; Case/Package: SOT-23-8; Mount: Surface Mount
U8 = CMP-318-000000-2: Automotive CAN FD transceiver with watchdog, bus diagnostics and partial networking via sele 14-SOT-23-THIN -40 to 150; Component Type: Standard; Design Item ID: CMP-015-00012-2; Pin Count: 14; Source: TCAN1146DYYRQ1.SchLib
U9 = CMP-019-00041-1: Ldo Cmos Lowcurr SOT23 T&r 3K
Y1 = CMP-27762-011708-1: Crystal 48MHz ±20ppm 18pF SMD-4 3.2mm x 2.5mm; Series Resistance: 35R; Frequency Stability: 50ppm; Package Quantity: 1000; Packaging: Tape and Reel; Mount: Surface Mount; Length: 3.2mm; Load Capacitance: 18pF; Max Operating Temperature: 70°C; Operating Frequency: 48 MHz; RoHS Compliant: Yes; Series: ABM8; Frequency Tolerance: 20ppm; Lead Free: Lead Free; Min Operating Temperature: -20°C; Case/Package: CSMD; Number of Pins: 4; Height: 0.031inch; ESR (Equivalent Series Resistance): 35R; Frequency: 48MHz; Radiation Hardening: No; Width: 0.098inch; Tolerance: 20ppm; Termination: SMD/SMT; Depth: 2.5mm; Resistor Type: Ceramic; REACH SVHC: No SVHC
Y2 = CMP-40224-000006-1: CRYSTAL 32.7680KHZ 12.5PF SMD; Manufacturer: ECS International; Frequency: 32.768kHz; Esr: 90kΩ; Tolerance: 20ppm; Device Class L1: Passive Components; Load Capacitance: 12.5pF; Temperature: -40°C to +85°C; ComponentLink2URL: https://ecsxtal.com/store/pdf/ECX-1210.pdf; Series: ECX-1210; Octopart: https://octopart.com/ecs-.327-12.5-1210-tr-ecs+international-81221340; ComponentLink2Description: Datasheet; Temperature Range Low: -40°C; Digikey Description: CRYSTAL 32.7680KHZ 12.5PF SMD; Lead Free: Yes; RoHS: TRUE; Device Class L3: Crystals; Automotive: No; Category: Crys; Height: 0.5mm; Manufacturer Part Number: ECS-.327-12.5-1210-TR; Temperature Range High: +85°C; Device Class L2: Crystals / Oscillators; Package: ECX-1210

## Sheet EJECTION_CIRCUIT.SchDoc
size B; SheetNumber: 3; SheetTotal: 6
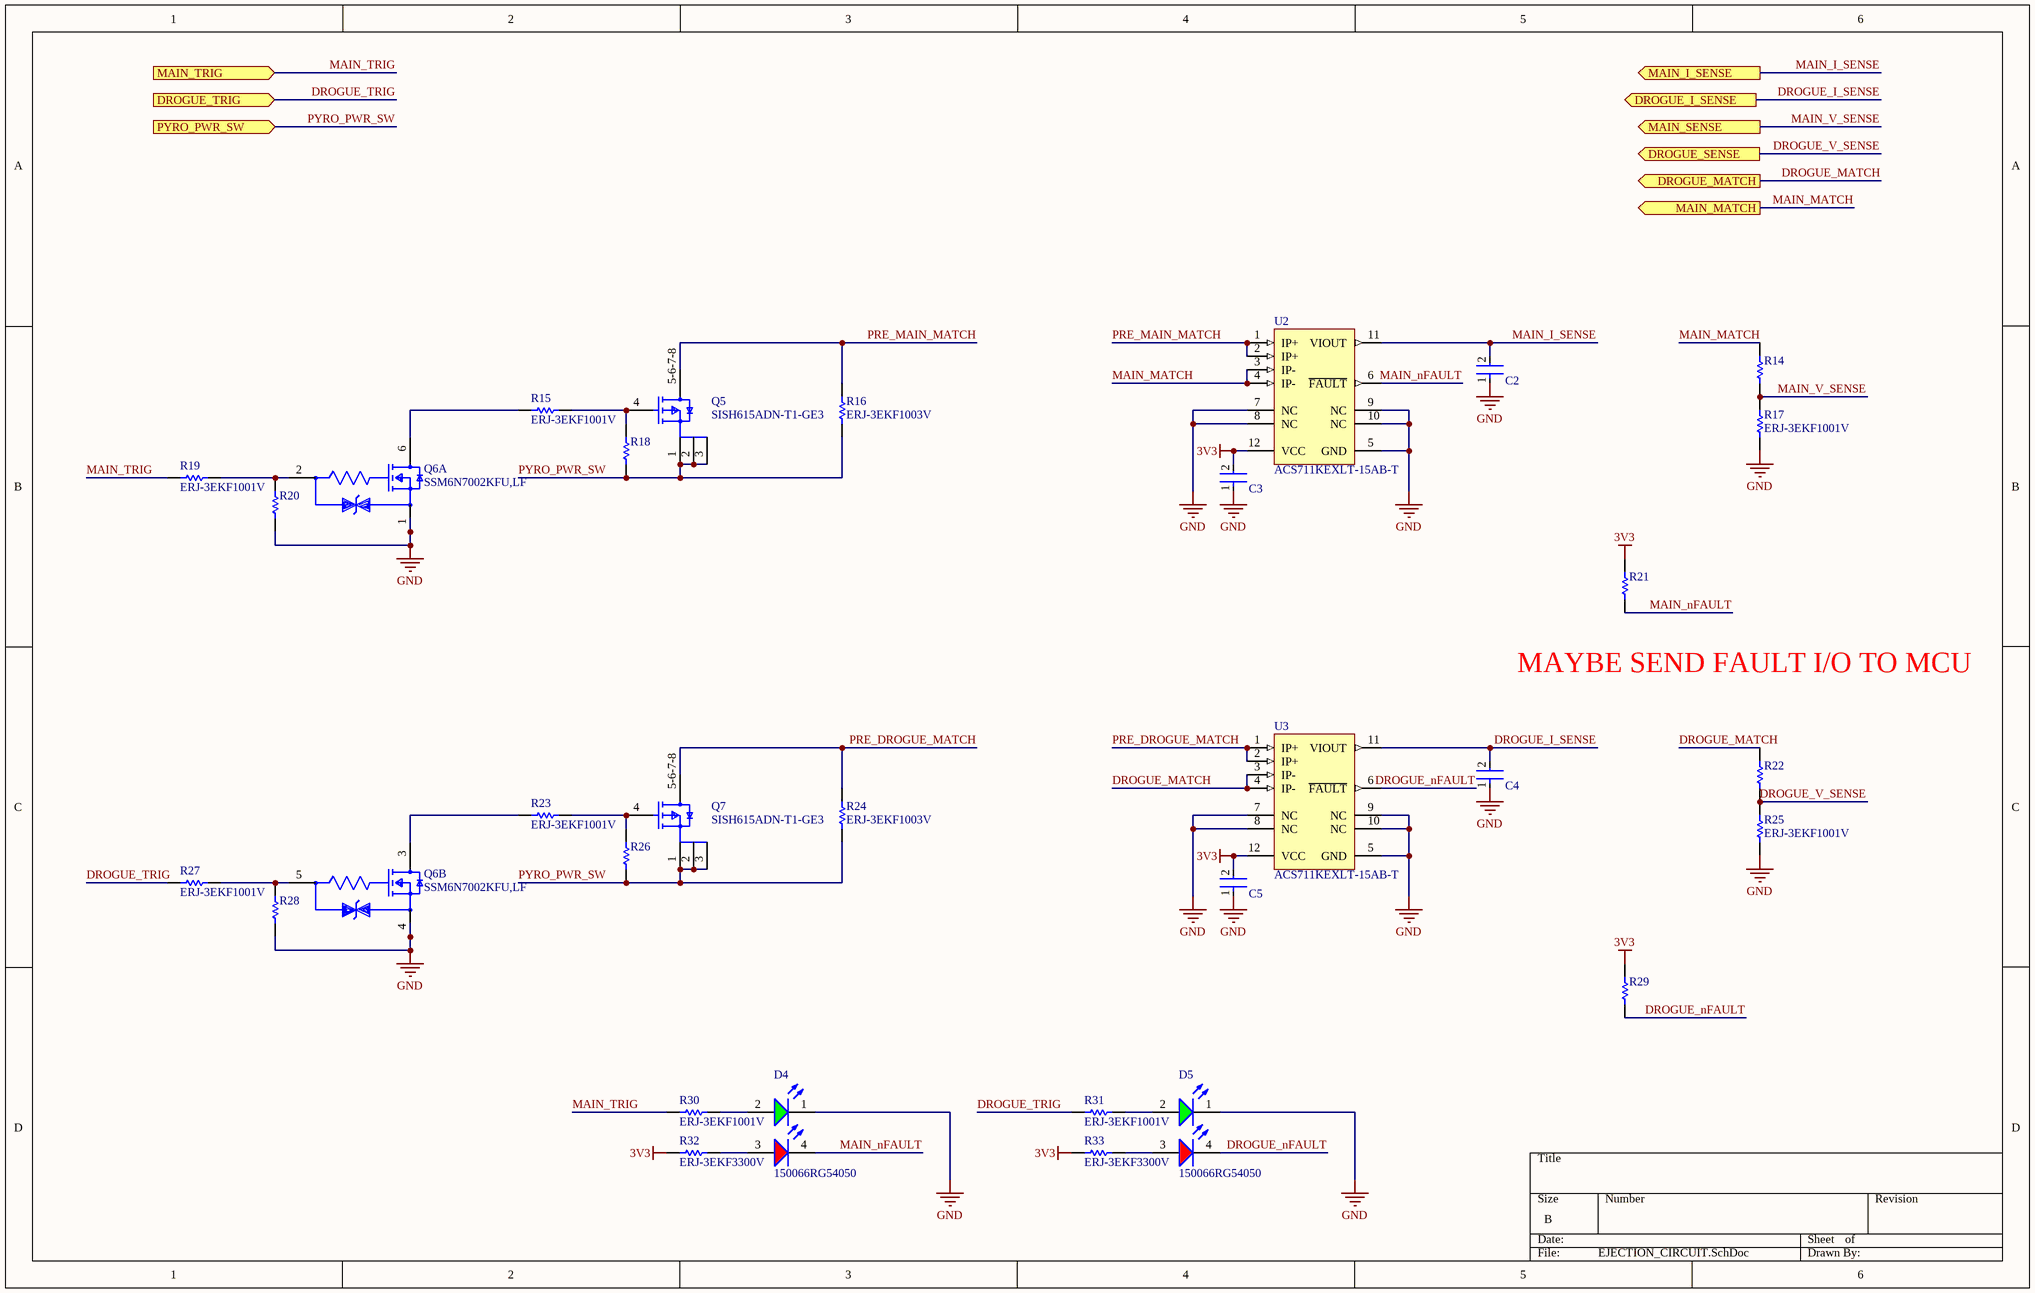
[diagram p5: EJECTION_CIRCUIT.SchDoc]

### Parts
C2  C0402C104K8PACTU  [FP-C0402-BB-MFG]  (value not drawn)
C3  C0402C104K8PACTU  [FP-C0402-BB-MFG]  (value not drawn)
C4  C0402C104K8PACTU  [FP-C0402-BB-MFG]  (value not drawn)
C5  C0402C104K8PACTU  [FP-C0402-BB-MFG]  (value not drawn)
D4  150066RG54050  [WL-SBCD_0606]
D5  150066RG54050  [WL-SBCD_0606]
Q5  SISH615ADN-T1-GE3  [SISH615ADN-T1-GE3-Footprint-1]
Q6  SSM6N7002KFU,LF  [FP-SSOP6-P-0_65A-MFG]  (parts A,B of 2)
Q7  SISH615ADN-T1-GE3  [SISH615ADN-T1-GE3-Footprint-1]
R14  ERJ3EKF1002V  [RESC1609X55X30LL15T15]  (value not drawn)
R15  ERJ-3EKF1001V  [RESC1608X55X30LL15T15]
R16  ERJ-3EKF1003V  [RESC1608X55X30ML15T15]
R17  ERJ-3EKF1001V  [RESC1608X55X30LL15T15]
R18  ERJ3EKF1002V  [RESC1609X55X30LL15T15]  (value not drawn)
R19  ERJ-3EKF1001V  [RESC1608X55X30LL15T15]
R20  ERJ3EKF1002V  [RESC1609X55X30LL15T15]  (value not drawn)
R21  ERJ3EKF1002V  [RESC1609X55X30LL15T15]  (value not drawn)
R22  ERJ3EKF1002V  [RESC1609X55X30LL15T15]  (value not drawn)
R23  ERJ-3EKF1001V  [RESC1608X55X30LL15T15]
R24  ERJ-3EKF1003V  [RESC1608X55X30ML15T15]
R25  ERJ-3EKF1001V  [RESC1608X55X30LL15T15]
R26  ERJ3EKF1002V  [RESC1609X55X30LL15T15]  (value not drawn)
R27  ERJ-3EKF1001V  [RESC1608X55X30LL15T15]
R28  ERJ3EKF1002V  [RESC1609X55X30LL15T15]  (value not drawn)
R29  ERJ3EKF1002V  [RESC1609X55X30LL15T15]  (value not drawn)
R30  ERJ-3EKF1001V  [RESC1608X55X30LL15T15]
R31  ERJ-3EKF1001V  [RESC1608X55X30LL15T15]
R32  ERJ-3EKF3300V  [RESC1608X55X30LL15T15]
R33  ERJ-3EKF3300V  [RESC1608X55X30LL15T15]
U2  ACS711KEXLT-15AB-T  [ALEG-EX-12_V]
U3  ACS711KEXLT-15AB-T  [ALEG-EX-12_V]

### Ports
DROGUE_I_SENSE (out, see HYDRA_V3_RECOVERY[4A], STM32G473CET6_PINOUT[5A]), DROGUE_MATCH (out, see HYDRA_V3_RECOVERY[4A]), DROGUE_SENSE (out, see HYDRA_V3_RECOVERY[4A], STM32G473CET6_PINOUT[5A]), DROGUE_TRIG (in, see HYDRA_V3_RECOVERY[4A], STM32G473CET6_PINOUT[5A]), MAIN_I_SENSE (out, see HYDRA_V3_RECOVERY[4A], STM32G473CET6_PINOUT[5A]), MAIN_MATCH (out, see HYDRA_V3_RECOVERY[4A]), MAIN_SENSE (out, see HYDRA_V3_RECOVERY[4A], STM32G473CET6_PINOUT[5A]), MAIN_TRIG (in, see HYDRA_V3_RECOVERY[4A], STM32G473CET6_PINOUT[5A]), PYRO_PWR_SW (in, see HYDRA_V3_RECOVERY[4A], SAFETY_SWITCH[2A])

### Nets
3V3: C3.2 C5.2 R21.2 R29.2 R32.1 R33.1 U2.12(VCC) U3.12(VCC)
GND: C2.1 C3.1 C4.1 C5.1 D4.1(K) D5.1(K) Q6.1(Source1) Q6.4(Source2) R17.1 R20.1 R25.1 R28.1 U2.5(GND) U2.7(NC) U2.8(NC) U2.9(NC) U2.10(NC) U3.5(GND) U3.7(NC) U3.8(NC) U3.9(NC) U3.10(NC)
DROGUE_I_SENSE: C4.2 U3.11(VIOUT) ; port DROGUE_I_SENSE
DROGUE_MATCH: R22.2 U3.3(IP-) U3.4(IP-) ; port DROGUE_MATCH
DROGUE_nFAULT: D5.4(K) R29.1 U3.6(~{FAULT})
DROGUE_TRIG: R27.1 R31.1 ; port DROGUE_TRIG
DROGUE_V_SENSE: R22.1 R25.2 ; port DROGUE_SENSE  [project net DROGUE_SENSE]
MAIN_I_SENSE: C2.2 U2.11(VIOUT) ; port MAIN_I_SENSE
MAIN_MATCH: R14.2 U2.3(IP-) U2.4(IP-) ; port MAIN_MATCH
MAIN_nFAULT: D4.4(K) R21.1 U2.6(~{FAULT})
MAIN_TRIG: R19.1 R30.1 ; port MAIN_TRIG
MAIN_V_SENSE: R14.1 R17.2 ; port MAIN_SENSE  [project net MAIN_SENSE]
PRE_DROGUE_MATCH: Q7.5-6-7-8(D) R24.2 U3.1(IP+) U3.2(IP+)
PRE_MAIN_MATCH: Q5.5-6-7-8(D) R16.2 U2.1(IP+) U2.2(IP+)
PYRO_PWR_SW: Q5.1(S) Q5.2(S) Q5.3(S) Q7.1(S) Q7.2(S) Q7.3(S) R16.1 R18.1 R24.1 R26.1 ; port PYRO_PWR_SW
NetD4_2: D4.2(A) R30.2
NetD4_3: D4.3(A) R32.2
NetD5_2: D5.2(A) R31.2
NetD5_3: D5.3(A) R33.2
NetQ5_4: Q5.4(G) R15.2 R18.2
NetQ6_2: Q6.2(Gate1) R19.2 R20.2
NetQ6_3: Q6.3(Drain2) R23.1
NetQ6_5: Q6.5(Gate2) R27.2 R28.2
NetQ6_6: Q6.6(Drain1) R15.1
NetQ7_4: Q7.4(G) R23.2 R26.2

### Notes on the sheet
- (near R21) MAYBE SEND FAULT I/O TO MCU

### Library data of the parts
C2-C5 = CMP-2008-02046-2: as C1 on sheet OC_PROT; Package: C0402-BB; Temperature: -55°C to +125°C; ComponentLink2Description: Datasheet; Temperature Characteristic: X5R; Device Class L1: Passive Components; Height: 0.55mm; Lead Free: Yes; ComponentLink2URL: https://content.kemet.com/datasheets/KEM_C1002_X7R_SMD.pdf; Device Class L2: Capacitors; Temperature Range Low: -55°C; Temperature Range High: +125°C; RoHS: TRUE; Octopart: https://octopart.com/c0402c104k8pactu-kemet-140039; Automotive: No; Mouser Description: Capacitor 100 nF 10 VDC 0402; Category: Cap; Voltage Rating: 10 V; Digikey Description: CAP CER 0.1UF 10V X5R 0402; Ipc Land Pattern Name: CAPC10050X50; Device Class L3: Ceramic Capacitors; Manufacturer Part Number: C0402C104K8PACTU
D4 D5 = CMP-004-00040-2: as D1 on sheet OC_PROT; Source: rgled.SchLib; Component Type: Standard; Design Item ID: CMP-004-00034-2; Pins: 4
Q5 Q7 = CMP-013-00018-2: as Q3 on sheet OC_PROT; Source: SISH615ADN-T1-GE3.SchLib; Design Item ID: CMP-013-00036-4; Component Type: Standard; Pins: 5
Q6 = CMP-35916-000009-1: MOSFET 2N-CH 60V 0.3A; Input Capacitance: 40pF; Continuous Drain Current (ID): 300mA; Max Power Dissipation: 285mW; FET Type: 2 N-Channel; Rds On Max: 1.5R; Mount: Surface Mount; Drain to Source Voltage (Vdss): 60V; Packaging: Tape and Reel
R14 R18 R20-R22 R26 R28 R29 = CMP-1012-00623-3: as R2 on sheet OC_PROT; Number of Pins: 2; Package Reference: 603; Depth: 0.8mm; Mount: SurfaceMount; Package Description: 2-Pin Surface Mount Device, Body 1.6 x 0.85 mm; Datasheet Version: 02/2017; Length: 1.6mm; Lead Free: LeadFree; Height: 0.45mm; Number of Terminations: 2; Max Power Dissipation: 100mW; Min Operating Temperature: -55degC; Datasheet URL: https://industrial.panasonic.com/cdbs/www-data/pdf/RDA0000/AOA0000C304.pdf; Termination: SMD/SMT; Case Code (Metric): 1608; Case Code (Imperial): 0603; Tolerance: 1%; Max Operating Temperature: 155degC; RoHSCompliant: true; Voltage Rating (DC): 75V; Radiation Hardening: No; Packaging: TapeandReel; Composition: ThickFilm; Mounting Technology: SurfaceMount; Manufacturer URL: http://www.panasonic.com/; Width: 0.031inch; REACH SVHC: NoSVHC; Contact Plating: Tin; Military Standard: Not; Package Quantity: 1
R15 R17 R19 R23 R25 R27 R30 R31 = CMP-2000-00180-1: Manufacturer: Panasonic; Part Number: ERJ-3EKF1001V
R16 R24 = CMP-2000-00182-1: Manufacturer: Panasonic; Part Number: ERJ-3EKF1003V
R32 R33 = CMP-2000-00435-2: as R1 on sheet OC_PROT; REACH SVHC: No SVHC; PackageDescription: 2-Pin Surface Mount Device, Body 1.6 x 0.85 mm; Contact Finish: Gold; Pins: 8; ComponentLink1Description: Manufacturer URL; Packaging: Tape and Reel; Max Operating Temperature: 85 degC; Contact Material: Copper; Height: 1.45 mm; Width: 1.45 mm; DatasheetVersion: Apr-15; Package Quantity: 1500; Contact Plating: Gold; PackageReference: 0603; Mount: Surface Mount; Lead Pitch: 1.1 mm; Min Operating Temperature: -25 degC; ComponentLink1URL: http://www.panasonic.com/; ComponentLink2URL: http://industrial.panasonic.com/cdbs/www-data/pdf/RDA0000/AOA0000C86.pdf; Length: 13.7 mm; ComponentLink2Description: Datasheet; RoHSCompliant: true
U2 U3 = CMP-1557-00001-1: as U10 on sheet OC_PROT; PackageDescription: 12-Pin Quad Flat No-Lead, Body 3 x 3 mm, Height 0.8 mm; ComponentLink1URL: http://www.allegromicro.com/; Packing: Tape and Reel; ComponentLink2URL: http://www.allegromicro.com/~/media/Files/Datasheets/ACS711-Datasheet.ashx?la=en; DatasheetVersion: Rev. 3; PartNumber: ACS711KEXLT-15AB-T; ComponentLink2Description: Datasheet; ComponentLink3URL: http://www.allegromicro.com/~/media/Files/Datasheets/ACS711-Datasheet.ashx?la=en; RoHS: TRUE; ComponentLink1Description: Manufacturer URL; ComponentLink3Description: Package Specification; Temperature Max: 125 degC; Mounting Technology: Surface Mount; Temperature Min: -40 degC